# Altium project FF_FINAL_PROJECT.PrjPcb (part 2 of 3)

## Sheet ADC.SchDoc
size 420 x 297 mm; Author: Nguyễn Huy Hoàng; SheetNumber: 3; SheetTotal: 5; Instructor: Nguyễn Trung Hiếu
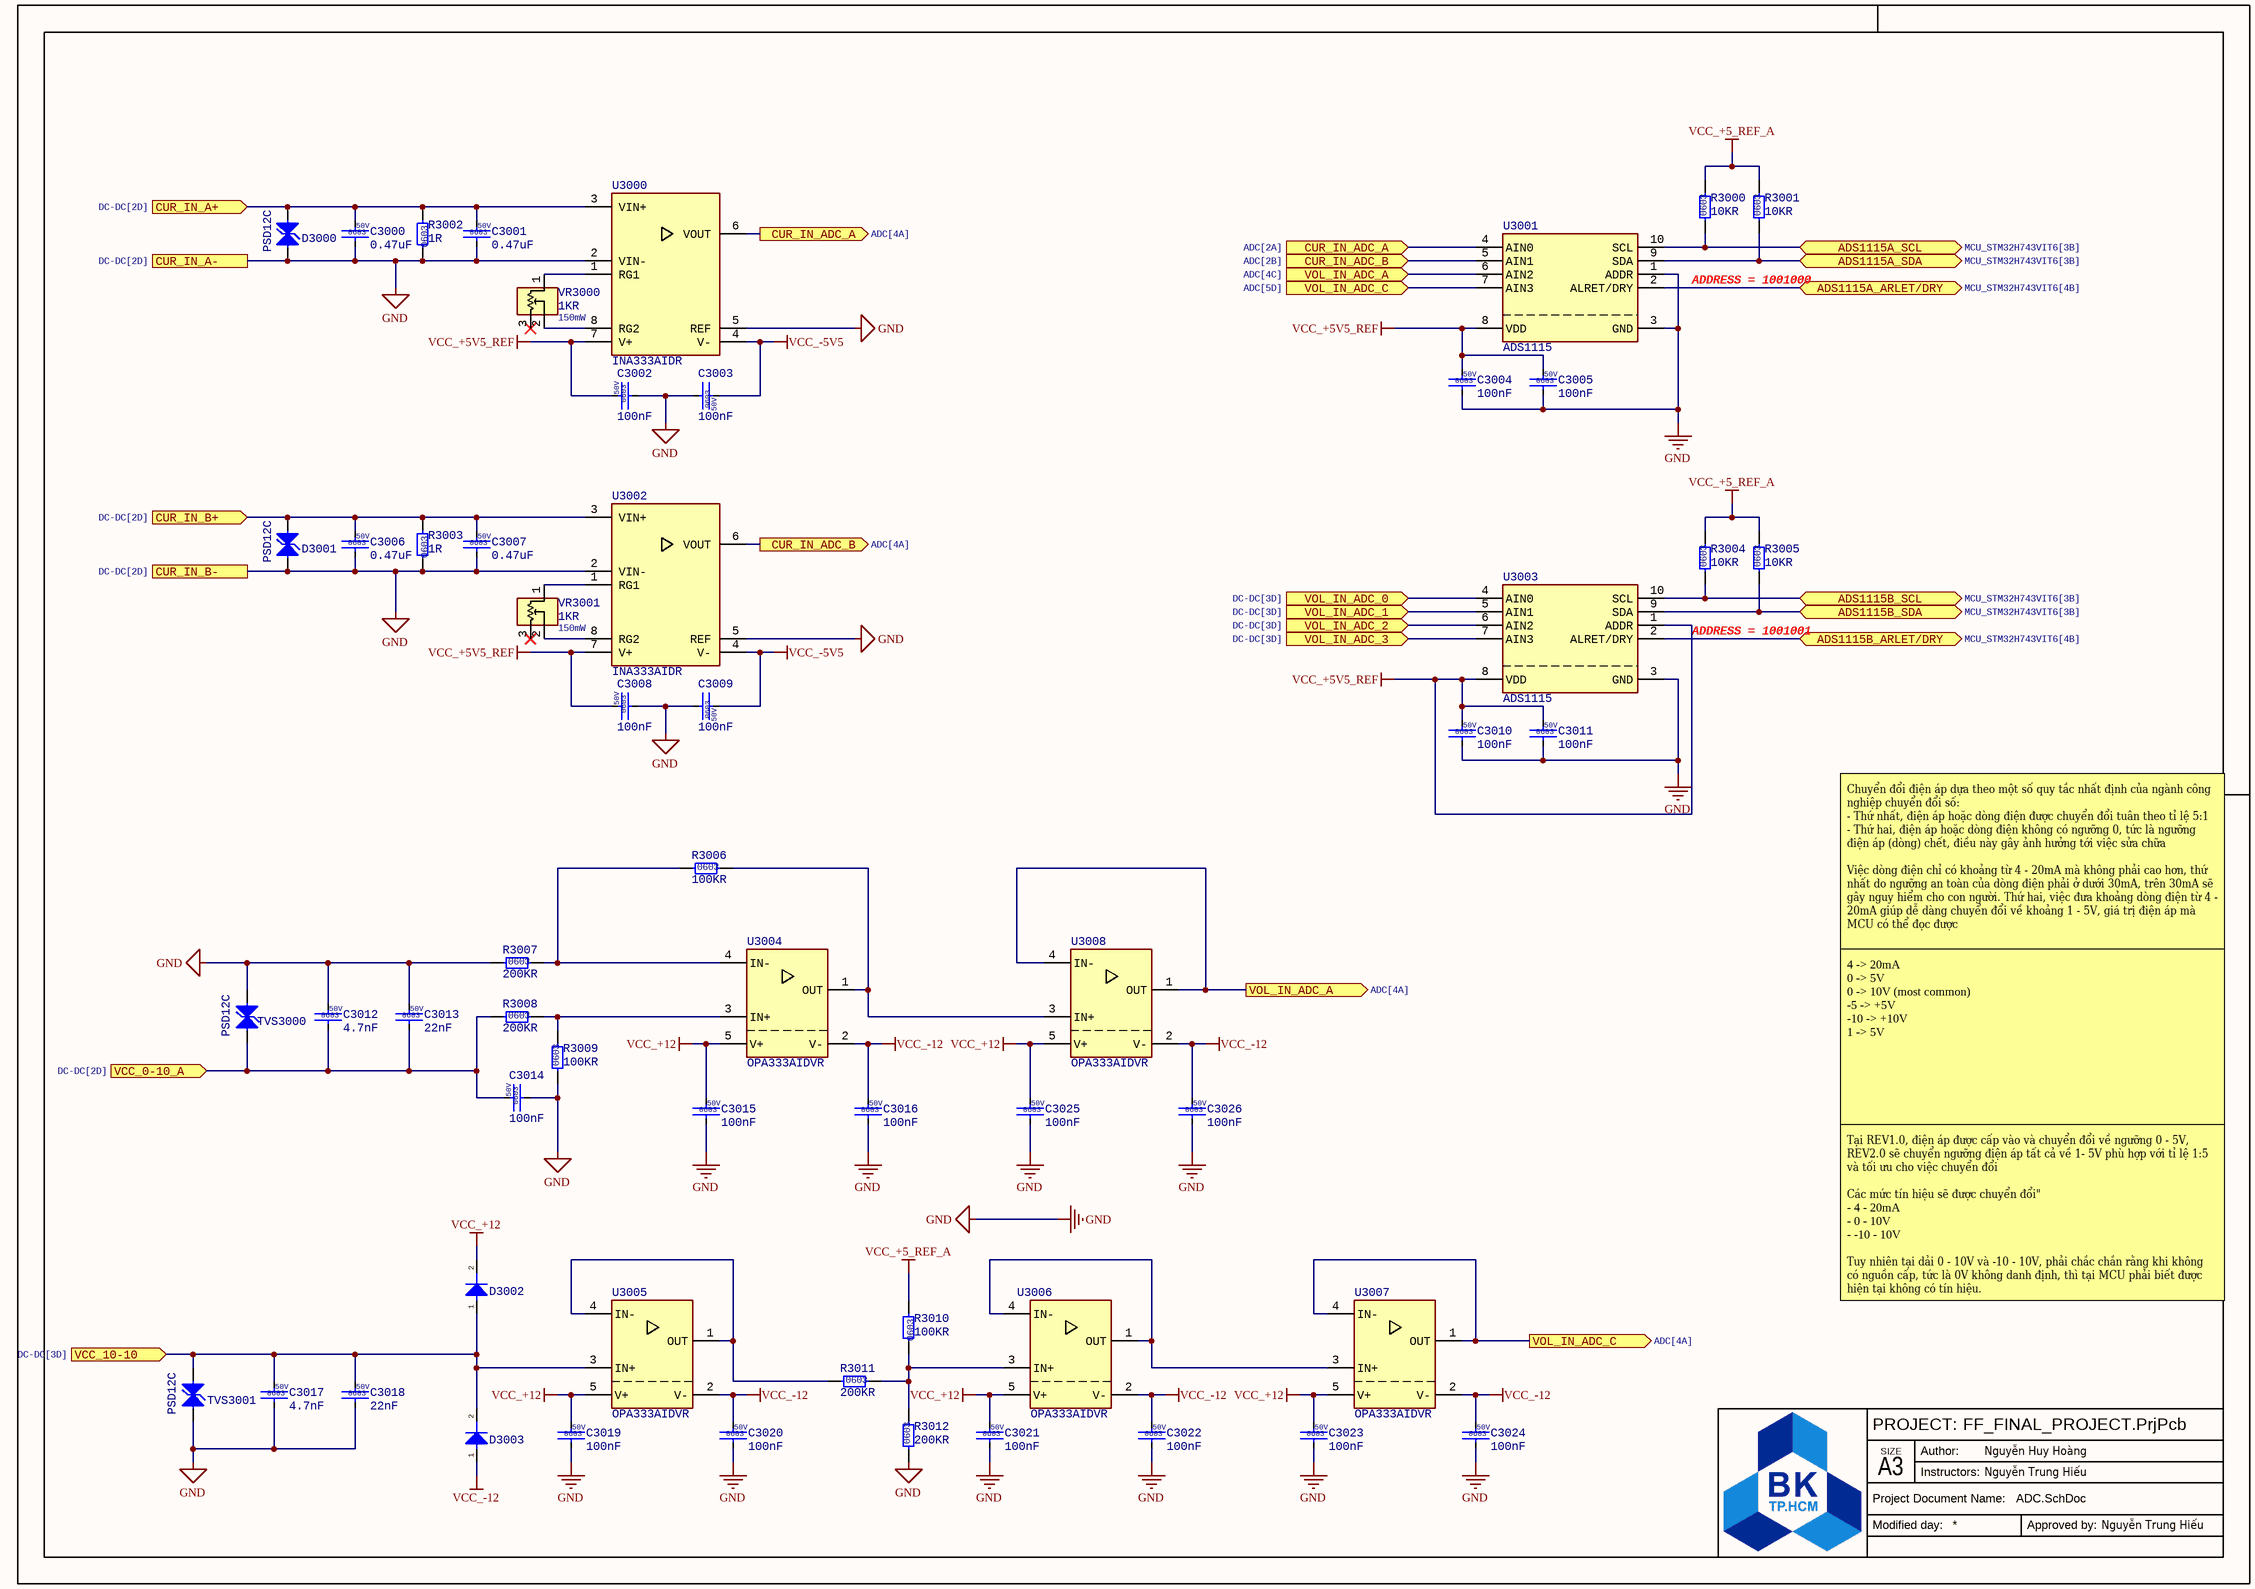
[diagram p3: ADC.SchDoc]

### Parts
C3000  0.47uF  Voltage: 50V  Size: 0603  [CAP CER 0603]
C3001  0.47uF  Voltage: 50V  Size: 0603  [CAP CER 0603]
C3002  100nF  Voltage: 50V  Size: 0603  [CAP CER 0603]
C3003  100nF  Voltage: 50V  Size: 0603  [CAP CER 0603]
C3004  100nF  Voltage: 50V  Size: 0603  [CAP CER 0603]
C3005  100nF  Voltage: 50V  Size: 0603  [CAP CER 0603]
C3006  0.47uF  Voltage: 50V  Size: 0603  [CAP CER 0603]
C3007  0.47uF  Voltage: 50V  Size: 0603  [CAP CER 0603]
C3008  100nF  Voltage: 50V  Size: 0603  [CAP CER 0603]
C3009  100nF  Voltage: 50V  Size: 0603  [CAP CER 0603]
C3010  100nF  Voltage: 50V  Size: 0603  [CAP CER 0603]
C3011  100nF  Voltage: 50V  Size: 0603  [CAP CER 0603]
C3012  4.7nF  Voltage: 50V  Size: 0603  [CAP CER 0603]
C3013  22nF  Voltage: 50V  Size: 0603  [CAP CER 0603]
C3014  100nF  Voltage: 50V  Size: 0603  [CAP CER 0603]
C3015  100nF  Voltage: 50V  Size: 0603  [CAP CER 0603]
C3016  100nF  Voltage: 50V  Size: 0603  [CAP CER 0603]
C3017  4.7nF  Voltage: 50V  Size: 0603  [CAP CER 0603]
C3018  22nF  Voltage: 50V  Size: 0603  [CAP CER 0603]
C3019  100nF  Voltage: 50V  Size: 0603  [CAP CER 0603]
C3020  100nF  Voltage: 50V  Size: 0603  [CAP CER 0603]
C3021  100nF  Voltage: 50V  Size: 0603  [CAP CER 0603]
C3022  100nF  Voltage: 50V  Size: 0603  [CAP CER 0603]
C3023  100nF  Voltage: 50V  Size: 0603  [CAP CER 0603]
C3024  100nF  Voltage: 50V  Size: 0603  [CAP CER 0603]
C3025  100nF  Voltage: 50V  Size: 0603  [CAP CER 0603]
C3026  100nF  Voltage: 50V  Size: 0603  [CAP CER 0603]
D3000  PSD12C  [SOD-323]
D3001  PSD12C  [SOD-323]
D3002  1N4148W-E3-18  [SOD-123]  (value not drawn)
D3003  1N4148W-E3-18  [SOD-123]  (value not drawn)
R3000  10KR  Size: 0603  [RESC 0603(1608) SMD]
R3001  10KR  Size: 0603  [RESC 0603(1608) SMD]
R3002  1R  Size: 0603  [RESC 0603(1608) SMD]
R3003  1R  Size: 0603  [RESC 0603(1608) SMD]
R3004  10KR  Size: 0603  [RESC 0603(1608) SMD]
R3005  10KR  Size: 0603  [RESC 0603(1608) SMD]
R3006  100KR  Size: 0603  [RESC 0603(1608) SMD]
R3007  200KR  Size: 0603  [RESC 0603(1608) SMD]
R3008  200KR  Size: 0603  [RESC 0603(1608) SMD]
R3009  100KR  Size: 0603  [RESC 0603(1608) SMD]
R3010  100KR  Size: 0603  [RESC 0603(1608) SMD]
R3011  200KR  Size: 0603  [RESC 0603(1608) SMD]
R3012  200KR  Size: 0603  [RESC 0603(1608) SMD]
TVS3000  PSD12C  [SOD-323]
TVS3001  PSD12C  [SOD-323]
U3000  INA333AIDR  [VSSOP-8]
U3001  ADS1115  [VSSOP-10]
U3002  INA333AIDR  [VSSOP-8]
U3003  ADS1115  [VSSOP-10]
U3004  OPA333AIDVR  [SOT23-5]
U3005  OPA333AIDVR  [SOT23-5]
U3006  OPA333AIDVR  [SOT23-5]
U3007  OPA333AIDVR  [SOT23-5]
U3008  OPA333AIDVR  [SOT23-5]
VR3000  1KR  Power Rate: 150mW  [VARIABLE RESISTOR]
VR3001  1KR  Power Rate: 150mW  [VARIABLE RESISTOR]

### Ports
ADS1115A_ARLET/DRY (bidir, see MCU_STM32H743VIT6[4B]), ADS1115A_SCL (bidir, see MCU_STM32H743VIT6[3B]), ADS1115A_SDA (bidir, see MCU_STM32H743VIT6[3B]), ADS1115B_ARLET/DRY (bidir, see MCU_STM32H743VIT6[4B]), ADS1115B_SCL (bidir, see MCU_STM32H743VIT6[3B]), ADS1115B_SDA (bidir, see MCU_STM32H743VIT6[3B]), CUR_IN_A+ (in, see DC-DC[2D]), CUR_IN_A- (see DC-DC[2D]), CUR_IN_ADC_A (in, see ADC[2A]), CUR_IN_ADC_A (out, see ADC[4A]), CUR_IN_ADC_B (in, see ADC[2B]), CUR_IN_ADC_B (out, see ADC[4A]), CUR_IN_B+ (in, see DC-DC[2D]), CUR_IN_B- (see DC-DC[2D]), VCC_0-10_A (in, see DC-DC[2D]), VCC_10-10 (in, see DC-DC[3D]), VOL_IN_ADC_0 (in, see DC-DC[3D]), VOL_IN_ADC_1 (in, see DC-DC[3D]), VOL_IN_ADC_2 (in, see DC-DC[3D]), VOL_IN_ADC_3 (in, see DC-DC[3D]), VOL_IN_ADC_A (in, see ADC[4C]), VOL_IN_ADC_A (out, see ADC[4A]), VOL_IN_ADC_C (in, see ADC[5D]), VOL_IN_ADC_C (out, see ADC[4A])

### Nets
GND: C3000.2 C3001.2 C3002.2 C3003.2 C3004.2 C3005.2 C3006.2 C3007.2 C3008.2 C3009.2 C3010.2 C3011.2 C3012.1 C3013.1 C3014.2 C3015.2 C3016.2 C3017.2 C3018.2 C3019.2 C3020.2 C3021.2 C3022.2 C3023.2 C3024.2 C3025.2 C3026.2 D3000.2 D3001.2 R3002.2 R3003.2 R3007.1 R3009.1 R3012.1 TVS3000.1 TVS3001.2 U3000.2(VIN-) U3000.5(REF) U3001.1(ADDR) U3001.3(GND) U3002.2(VIN-) U3002.5(REF) U3003.3(GND) ; port CUR_IN_A-, port CUR_IN_B-
VCC_+5_REF_A: R3000.2 R3001.2 R3004.2 R3005.2 R3010.1
VCC_+5V5_REF: C3002.1 C3004.1 C3005.1 C3008.1 C3010.1 C3011.1 U3000.7(V+) U3001.8(VDD) U3002.7(V+) U3003.1(ADDR) U3003.8(VDD)
VCC_+12: C3015.1 C3019.1 C3021.1 C3023.1 C3025.1 D3002.2(K) U3004.5(V+) U3005.5(V+) U3006.5(V+) U3007.5(V+) U3008.5(V+)
VCC_-5V5: C3003.1 C3009.1 U3000.4(V-) U3002.4(V-)
VCC_-12: C3016.1 C3020.1 C3022.1 C3024.1 C3026.1 D3003.1(A) U3004.2(V-) U3005.2(V-) U3006.2(V-) U3007.2(V-) U3008.2(V-)
CUR_IN_A+: C3000.1 C3001.1 D3000.1 R3002.1 U3000.3(VIN+) ; port CUR_IN_A+
CUR_IN_B+: C3006.1 C3007.1 D3001.1 R3003.1 U3002.3(VIN+) ; port CUR_IN_B+
I2C2_SCL: R3000.1 R3004.1 U3001.10(SCL) U3003.10(SCL) ; port ADS1115A_SCL, port ADS1115B_SCL
I2C2_SDA: R3001.1 R3005.1 U3001.9(SDA) U3003.9(SDA) ; port ADS1115A_SDA, port ADS1115B_SDA
MCU95: U3001.2(ALRET/DRY) ; port ADS1115A_ARLET/DRY
MCU96: U3003.2(ALRET/DRY) ; port ADS1115B_ARLET/DRY
VCC_0-10_A: C3012.2 C3013.2 C3014.1 R3008.1 TVS3000.2 ; port VCC_0-10_A
VCC_10-10: C3017.1 C3018.1 D3002.1(A) D3003.2(K) TVS3001.1 U3005.3(IN+) ; port VCC_10-10
VOL_IN_ADC_0: U3003.4(AIN0) ; port VOL_IN_ADC_0
VOL_IN_ADC_1: U3003.5(AIN1) ; port VOL_IN_ADC_1
VOL_IN_ADC_2: U3003.6(AIN2) ; port VOL_IN_ADC_2
VOL_IN_ADC_3: U3003.7(AIN3) ; port VOL_IN_ADC_3
NetR3006_1: R3006.1 R3007.2 U3004.4(IN-)
NetR3006_2: R3006.2 U3004.1(OUT) U3008.3(IN+)
NetR3008_2: R3008.2 R3009.2 U3004.3(IN+)
NetR3010_2: R3010.2 R3011.2 R3012.2 U3006.3(IN+)
NetR3011_1: R3011.1 U3005.1(OUT) U3005.4(IN-)
NetU3000_1: U3000.1(RG1) VR3000.1(a)
NetU3000_6: U3000.6(VOUT) U3001.4(AIN0) ; port CUR_IN_ADC_A
NetU3000_8: U3000.8(RG2) VR3000.2(b)
NetU3001_5: U3001.5(AIN1) U3002.6(VOUT) ; port CUR_IN_ADC_B
NetU3001_6: U3001.6(AIN2) U3008.1(OUT) U3008.4(IN-) ; port VOL_IN_ADC_A
NetU3001_7: U3001.7(AIN3) U3007.1(OUT) U3007.4(IN-) ; port VOL_IN_ADC_C
NetU3002_1: U3002.1(RG1) VR3001.1(a)
NetU3002_8: U3002.8(RG2) VR3001.2(b)
NetU3006_1: U3006.1(OUT) U3006.4(IN-) U3007.3(IN+)

Not connected (* = marked no-connect by the designer): VR3000 3(c)*; VR3001 3(c)*

### Notes on the sheet
- ADDRESS = 1001000
- ADDRESS = 1001001
- Chuyển đổi điện áp dựa theo một số quy tắc nhất định của ngành công nghiệp chuyển đổi số:
  - Thứ nhất, điện áp hoặc dòng điện được chuyển đổi tuân theo tỉ lệ 5:1
  - Thứ hai, điện áp hoặc dòng điện không có ngưỡng 0, tức là ngưỡng điện áp (dòng) chết, điều này gây ảnh hưởng tới việc sửa chữa
  Việc dòng điện chỉ có khoảng từ 4 - 20mA mà không phải cao hơn, thứ nhất do ngưỡng an toàn của dòng điện phải ở dưới 30mA, trên 30mA sẽ gây nguy hiểm cho con người. Thứ hai, việc đưa khoảng dòng điện từ 4 - 20mA giúp dễ dàng chuyển đổi về khoảng 1 - 5V, giá trị điện áp mà MCU có thể đọc được
- 4 -> 20mA
  0 -> 5V
  0 -> 10V (most common)
  -5 -> +5V
  -10 -> +10V
  1 -> 5V
- Tại REV1.0, điện áp được cấp vào và chuyển đổi về ngưỡng 0 - 5V, REV2.0 sẽ chuyển ngưỡng điện áp tất cả về 1- 5V phù hợp với tỉ lệ 1:5 và tối ưu cho việc chuyển đổi
  Các mức tín hiệu sẽ được chuyển đổi"
  - 4 - 20mA
  - 0 - 10V
  - -10 - 10V
  Tuy nhiên tại dải 0 - 10V và -10 - 10V, phải chắc chắn rằng khi không có nguồn cấp, tức là 0V không danh định, thì tại MCU phải biết được hiện tại không có tín hiệu.
- PROJECT:
- SIZE
- Author:
- Instructors:
- Project Document Name:
- Modified day:
- A3
- Approved by:

### Library data of the parts
C3000 C3001 C3006 C3007 = FF-1003: CAP CER SMD 0.47uF 10% 50V 0603; Type: CAP CER; Design Item ID: FF-1003; TH/SMD: SMD; Value: 0.47uF; Tolerance: 10%; Power Rate: N/A; Supplier: THEGIOIIC; Supplier Part Number: 10%, 0603 (1608 Metric); Supplier Link: https://www.thegioiic.com/tu-gom-0603-470nf-50v
C3002-C3005 C3008-C3011 C3014-C3016 C3019-C3026 = FF-1008: as C1018 on sheet DC-DC; Design Item ID: FF-1008; TH/SMD: SMD; Value: 100nF; Tolerance: 10%; Power Rate: N/A; Supplier: THEGIOIIC; Supplier Part Number: 10%, 0603 (1608 Metric); Supplier Link: https://www.thegioiic.com/tu-gom-0603-100nf-0-1uf-50v
C3012 C3017 = FF-1030: CAP CER SMD 4.7nF 10% 50V 0603; Type: CAP CER; Design Item ID: FF-1030; TH/SMD: SMD; Value: 4.7nF; Tolerance: 10%; Power Rate: N/A; Supplier: THEGIOIIC; Supplier Part Number: 10%, 0603 (1608 Metric); Supplier Link: https://www.thegioiic.com/tu-gom-0603-4-7nf-50v
C3013 C3018 = FF-1031: CAP CER SMD 22nF 10% 50V 0603; Type: CAP CER; Design Item ID: FF-1031; TH/SMD: SMD; Value: 22nF; Tolerance: 10%; Power Rate: N/A; Supplier: THEGIOIIC; Supplier Part Number: 10%, 0603 (1608 Metric); Supplier Link: https://www.thegioiic.com/tu-gom-0603-22nf-50v
D3000 D3001 TVS3000 TVS3001 = FF-4015: Package SOD323, Diode TVS, 50pF, 29.5V; TH/SMD: SMD; Design Item ID: FF-4015; Type: TVS DIODE; Value: 50 pF, 29.5V; Tolerance: N/A; Voltage: 29.5V; Power Rate: N/A; Size: SOD-323; Supplier: THEGIOIIC; Supplier Part Number: PSD12C; Supplier Link: https://www.thegioiic.com/psd12c
D3002 D3003 = FF-4016: Diode Standard 75V 150mA; TH/SMD: SMD; Design Item ID: FF-4016; Type: DIODE; Value: 75V 150mA; Tolerance: N/A; Voltage: 75V; Power Rate: N/A; Size: SOD-123; Supplier: THEGIOIIC; Supplier Part Number: 1N4148W-E3-18; Supplier Link: https://www.thegioiic.com/1n4148w-e3-18-diode-gen-purp-75v-150ma-sod123
R3000 R3001 R3004 R3005 = FF-0020: RESISTOR SMD 10KR OHM 1% 100mW 0603; Power Rate: 100mW; Design Item ID: FF-0020; Type: RESISTOR; TH/SMD: SMD; Value: 10KR; Tolerance: 1%; Voltage: N/A; Supplier: THEGIOIIC; Supplier Part Number: 103, 1/10W; Supplier Link: https://www.thegioiic.com/dien-tro-10-kohm-0603-1-
R3002 R3003 = FF-0011: RESISTOR SMD 1R OHM 1% 100mW 0603; Power Rate: 100mW; Design Item ID: FF-0011; Type: RESISTOR; TH/SMD: SMD; Value: 1R; Tolerance: 1%; Voltage: N/A; Supplier: THEGIOIIC; Supplier Part Number: 1R0, 1/10W; Supplier Link: https://www.thegioiic.com/dien-tro-1-ohm-0603-1-
R3006 R3009 R3010 = FF-0029: RESISTOR SMD 100KR OHM 1% 100mW 0603; Type: RESISTOR; TH/SMD: SMD; Value: 100KR; Tolerance: 1%; Voltage: N/A; Power Rate: 100mW; Supplier: THEGIOIIC; Supplier Part Number: 104, 1/10W; Supplier Link: https://www.thegioiic.com/dien-tro-100-kohm-0603-1-; Design Item ID: FF-0029
R3007 R3008 R3011 R3012 = FF-0036: RESISTOR SMD 200KR OHM 1% 100mW 0603; Type: RESISTOR; TH/SMD: SMD; Value: 200KR; Tolerance: 1%; Voltage: N/A; Power Rate: 100mW; Supplier: THEGIOIIC; Supplier Part Number: 2003, 1/10W; Supplier Link: https://www.thegioiic.com/dien-tro-200-kohm-0603-1-; Design Item ID: FF-0036
U3000 U3002 = FF-2005: INA333 Micro-Power (50μA), Zerø-Drift, Rail-to-Rail Out Instrumentation Amplifier; TH/SMD: SMD; Design Item ID: FF-2005; Type: IC; Value: INA333AIDR; Tolerance: N/A; Voltage: N/A; Power Rate: N/A; Size: VSSOP-8; Supplier: SELF
U3001 U3003 = FF-2002: ADS111x Ultra-Small, Low-Power, I2C-Compatible, 860-SPS, 16-Bit ADCs With Internal Reference, Oscillator, and Programmable Comparator; TH/SMD: SMD; Value: ADS1115; Design Item ID: FF-2002; Type: IC; Tolerance: N/A; Voltage: N/A; Power Rate: N/A; Size: VSSOP-10; Supplier: SELF
U3004-U3008 = FF-2010: OPAx333 1.8-V, microPower, CMOS Operational Amplifiers, Zero-Drift Series; TH/SMD: SMD; Design Item ID: FF-2010; Type: IC; Value: OPA333AIDVR; Tolerance: N/A; Voltage: N/A; Power Rate: N/A; Size: SOT23-5; Supplier: SELF; Supplier Link: https://shopee.vn/(10-C%C3%A1i)-Chip-100-Opa333Aidvr-OPA333-Oxq-sot23-5-M%E1%BB%9Bi-i.1003955517.21782141850?sp_atk=4701d033-6a8f-4bdf-a833-fbc55ec2f47d&xptdk=4701d033-6a8f-4bdf-a833-fbc55ec2f47d
VR3000 VR3001 = FF-0048: VARIABLE RESISTOR SMD 1KR OHM 20% 150mW N/A; Design Item ID: FF-0048; Size: N/A; Type: VARIABLE RESISTOR; TH/SMD: SMD; Value: 1KR; Tolerance: 20%; Voltage: N/A; Supplier: N/A; Supplier Part Number: 1K Ohm, 20%; Supplier Link: https://www.thegioiic.com/evm3e-102-bien-tro-1-kohm-nut-ao-smd-0-15w

## Sheet ESP32-LORA_RA_08H.SchDoc
size 420 x 297 mm; Author: Nguyễn Huy Hoàng; SheetNumber: 4; SheetTotal: 5; Instructor: Nguyễn Trung Hiếu
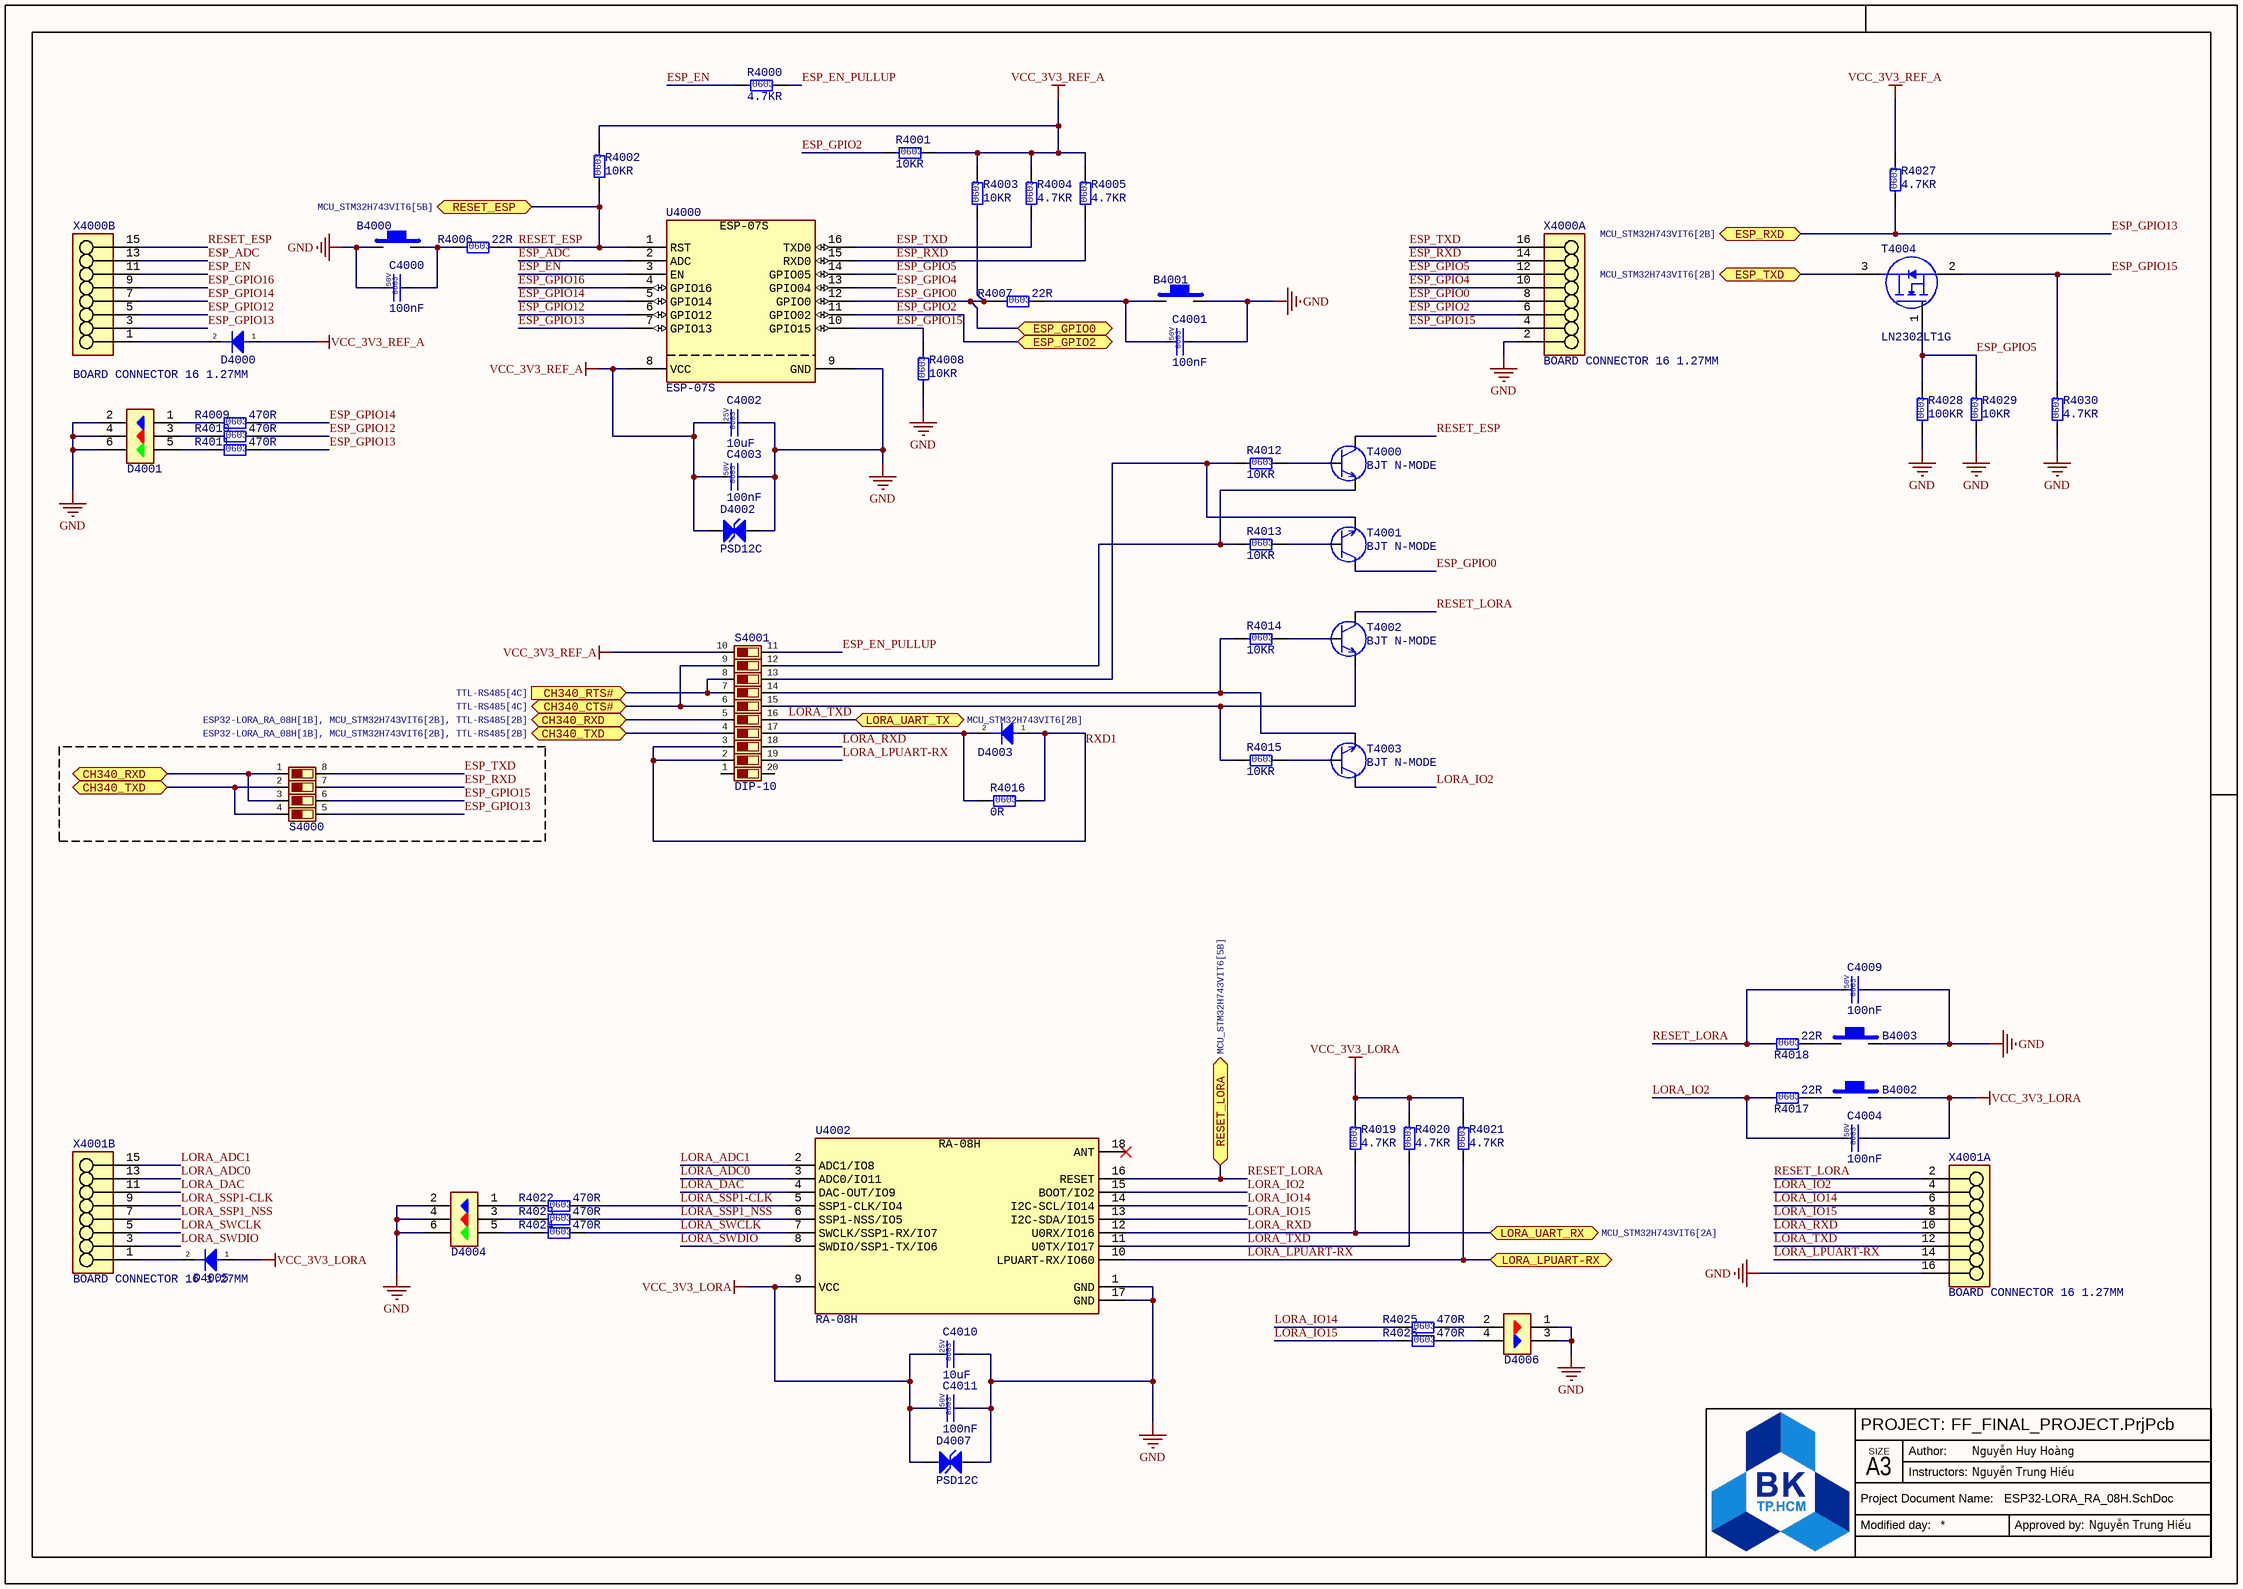
[diagram p4: ESP32-LORA_RA_08H.SchDoc]

### Parts
B4000  TACTILE 3X4MM  [TACTILE 3X4MM]  (value not drawn)
B4001  TACTILE 3X4MM  [TACTILE 3X4MM]  (value not drawn)
B4002  TACTILE 3X4MM  [TACTILE 3X4MM]  (value not drawn)
B4003  TACTILE 3X4MM  [TACTILE 3X4MM]  (value not drawn)
C4000  100nF  Voltage: 50V  Size: 0603  [CAP CER 0603]
C4001  100nF  Voltage: 50V  Size: 0603  [CAP CER 0603]
C4002  10uF  Voltage: 25V  Size: 0603  [CAP CER 0603]
C4003  100nF  Voltage: 50V  Size: 0603  [CAP CER 0603]
C4004  100nF  Voltage: 50V  Size: 0603  [CAP CER 0603]
C4009  100nF  Voltage: 50V  Size: 0603  [CAP CER 0603]
C4010  10uF  Voltage: 25V  Size: 0603  [CAP CER 0603]
C4011  100nF  Voltage: 50V  Size: 0603  [CAP CER 0603]
D4000  1N4148W-E3-18  [SOD-123]  (value not drawn)
D4001  LED RGB 5050  [LED RGB 5050]  (value not drawn)
D4002  PSD12C  [SOD-323]
D4003  1N4148W-E3-18  [SOD-123]  (value not drawn)
D4004  LED RGB 5050  [LED RGB 5050]  (value not drawn)
D4005  1N4148W-E3-18  [SOD-123]  (value not drawn)
D4006  LED R/B 0805  [LED RB 0805]  (value not drawn)
D4007  PSD12C  [SOD-323]
R4000  4.7KR  Size: 0603  [RESC 0603(1608) SMD]
R4001  10KR  Size: 0603  [RESC 0603(1608) SMD]
R4002  10KR  Size: 0603  [RESC 0603(1608) SMD]
R4003  10KR  Size: 0603  [RESC 0603(1608) SMD]
R4004  4.7KR  Size: 0603  [RESC 0603(1608) SMD]
R4005  4.7KR  Size: 0603  [RESC 0603(1608) SMD]
R4006  22R  Size: 0603  [RESC 0603(1608) SMD]
R4007  22R  Size: 0603  [RESC 0603(1608) SMD]
R4008  10KR  Size: 0603  [RESC 0603(1608) SMD]
R4009  470R  Size: 0603  [RESC 0603(1608) SMD]
R4010  470R  Size: 0603  [RESC 0603(1608) SMD]
R4011  470R  Size: 0603  [RESC 0603(1608) SMD]
R4012  10KR  Size: 0603  [RESC 0603(1608) SMD]
R4013  10KR  Size: 0603  [RESC 0603(1608) SMD]
R4014  10KR  Size: 0603  [RESC 0603(1608) SMD]
R4015  10KR  Size: 0603  [RESC 0603(1608) SMD]
R4016  0R  Size: 0603  [RESC 0603(1608) SMD]
R4017  22R  Size: 0603  [RESC 0603(1608) SMD]
R4018  22R  Size: 0603  [RESC 0603(1608) SMD]
R4019  4.7KR  Size: 0603  [RESC 0603(1608) SMD]
R4020  4.7KR  Size: 0603  [RESC 0603(1608) SMD]
R4021  4.7KR  Size: 0603  [RESC 0603(1608) SMD]
R4022  470R  Size: 0603  [RESC 0603(1608) SMD]
R4023  470R  Size: 0603  [RESC 0603(1608) SMD]
R4024  470R  Size: 0603  [RESC 0603(1608) SMD]
R4025  470R  Size: 0603  [RESC 0603(1608) SMD]
R4026  470R  Size: 0603  [RESC 0603(1608) SMD]
R4027  4.7KR  Size: 0603  [RESC 0603(1608) SMD]
R4028  100KR  Size: 0603  [RESC 0603(1608) SMD]
R4029  10KR  Size: 0603  [RESC 0603(1608) SMD]
R4030  4.7KR  Size: 0603  [RESC 0603(1608) SMD]
S4000  DIP-4  [DIP-4 SWITCH]  (value not drawn)
S4001  DIP-10  [DIP-10 SWITCH]
T4000  BJT N-MODE  [SOT23-3]
T4001  BJT N-MODE  [SOT23-3]
T4002  BJT N-MODE  [SOT23-3]
T4003  BJT N-MODE  [SOT23-3]
T4004  LN2302LT1G  [SOT23-3]
U4000  ESP-07S  [ESP-07S]
U4002  RA-08H  [RA-08H]
X4000  BOARD CONNECTOR 16 1.27MM  [BOARD CONNECTOR 16 1.27MM]  (parts A,B of 2)
X4001  BOARD CONNECTOR 16 1.27MM  [BOARD CONNECTOR 16 1.27MM]  (parts A,B of 2)

### Ports
CH340_CTS# (bidir, see TTL-RS485[4C]), CH340_RTS# (in, see TTL-RS485[4C]), CH340_RXD (bidir, see ESP32-LORA_RA_08H[1B], MCU_STM32H743VIT6[2B], TTL-RS485[2B]), CH340_RXD (bidir, see ESP32-LORA_RA_08H[2B], MCU_STM32H743VIT6[2B], TTL-RS485[2B]), CH340_TXD (bidir, see ESP32-LORA_RA_08H[1B], MCU_STM32H743VIT6[2B], TTL-RS485[2B]), CH340_TXD (bidir, see ESP32-LORA_RA_08H[2B], MCU_STM32H743VIT6[2B], TTL-RS485[2B]), ESP_GPIO0 (bidir), ESP_GPIO2 (bidir), ESP_RXD (bidir, see MCU_STM32H743VIT6[2B]), ESP_TXD (bidir, see MCU_STM32H743VIT6[2B]), LORA_LPUART-RX (bidir), LORA_UART_RX (bidir, see MCU_STM32H743VIT6[2A]), LORA_UART_TX (bidir, see MCU_STM32H743VIT6[2B]), RESET_ESP (bidir, see MCU_STM32H743VIT6[5B]), RESET_LORA (bidir, see MCU_STM32H743VIT6[5B])

### Nets
GND: B4000.1 B4001.2 B4003.2 C4000.1 C4001.2 C4002.2 C4003.2 C4009.2 C4010.2 C4011.2 D4001.2 D4001.4 D4001.6 D4002.2 D4004.2 D4004.4 D4004.6 D4006.1 D4006.3 D4007.2 R4008.1 R4028.1 R4029.1 R4030.1 U4000.9(GND) U4002.1(GND) U4002.17(GND) X4000.2 X4001.16
VCC_3V3_LORA: B4002.2 C4002.1 C4003.1 C4004.2 C4010.1 C4011.1 D4000.1(A) D4002.1 D4005.1(A) D4007.1 R4001.2 R4002.2 R4003.2 R4004.2 R4005.2 R4019.2 R4020.2 R4021.2 R4027.2 S4001.10 U4000.8(VCC) U4002.9(VCC)  [also labelled VCC_3V3_REF_A]
CH340_CTS#: S4001.6 S4001.9 ; port CH340_CTS#
CH340_RTS#: S4001.7 S4001.8 ; port CH340_RTS#
CH340_RXD: S4000.1 S4000.3 S4001.5 ; port CH340_RXD
CH340_TXD: S4000.2 S4000.4 S4001.4 ; port CH340_TXD
ESP_ADC: U4000.2(ADC) X4000.13
ESP_EN: R4000.1 U4000.3(EN) X4000.11
ESP_EN_PULLUP: R4000.2 S4001.11
ESP_GPIO0: R4003.1 R4007.1 T4001.3 U4000.12(GPIO0) X4000.8 ; port ESP_GPIO0
ESP_GPIO2: R4001.1 U4000.11(GPIO02) X4000.6 ; port ESP_GPIO2
ESP_GPIO4: U4000.13(GPIO04) X4000.10
ESP_GPIO5: R4028.2 R4029.2 T4004.1(G) U4000.14(GPIO05) X4000.12
ESP_GPIO12: R4010.2 U4000.6(GPIO12) X4000.5
ESP_GPIO13: R4011.2 R4027.1 S4000.5 U4000.7(GPIO13) X4000.3 ; port ESP_RXD
ESP_GPIO14: R4009.2 U4000.5(GPIO14) X4000.7
ESP_GPIO15: R4008.2 R4030.2 S4000.6 T4004.2(S) U4000.10(GPIO15) X4000.4
ESP_GPIO16: U4000.4(GPIO16) X4000.9
ESP_RXD: R4005.1 S4000.7 U4000.15(RXD0) X4000.14
ESP_TXD: R4004.1 S4000.8 U4000.16(TXD0) X4000.16
LORA_ADC0: U4002.3(ADC0/IO11) X4001.13
LORA_ADC1: U4002.2(ADC1/IO8) X4001.15
LORA_DAC: U4002.4(DAC-OUT/IO9) X4001.11
LORA_IO2: C4004.1 R4017.1 T4003.3 U4002.15(BOOT/IO2) X4001.4
LORA_IO14: R4025.1 U4002.14(I2C-SCL/IO14) X4001.6
LORA_IO15: R4026.1 U4002.13(I2C-SDA/IO15) X4001.8
LORA_LPUART-RX: R4021.1 S4001.19 U4002.10(LPUART-RX/IO60) X4001.14 ; port LORA_LPUART-RX
LORA_RXD: R4019.1 S4001.18 U4002.12(U0RX/IO16) X4001.10 ; port LORA_UART_RX
LORA_SSP1-CLK: R4022.2 U4002.5(SSP1-CLK/IO4) X4001.9
LORA_SSP1_NSS: R4023.2 U4002.6(SSP1-NSS/IO5) X4001.7
LORA_SWCLK: R4024.2 U4002.7(SWCLK/SSP1-RX/IO7) X4001.5
LORA_SWDIO: U4002.8(SWDIO/SSP1-TX/IO6) X4001.3
LORA_TXD: R4020.1 S4001.16 U4002.11(U0TX/IO17) X4001.12 ; port LORA_UART_TX
RESET_ESP: R4002.1 R4006.2 T4000.3 U4000.1(RST) X4000.15 ; port RESET_ESP  [project net MCU87]
RESET_LORA: C4009.1 R4018.1 T4002.3 U4002.16(RESET) X4001.2 ; port RESET_LORA  [project net MCU88]
RXD1: D4003.1(A) R4016.2 S4001.2 S4001.3
NetB4000_2: B4000.2 C4000.2 R4006.1
NetB4001_1: B4001.1 C4001.1 R4007.2
NetB4002_1: B4002.1 R4017.2
NetB4003_1: B4003.1 R4018.2
NetD4000_2: D4000.2(K) X4000.1
NetD4001_1: D4001.1 R4009.1
NetD4001_3: D4001.3 R4010.1
NetD4001_5: D4001.5 R4011.1
NetD4003_2: D4003.2(K) R4016.1 S4001.17
NetD4004_1: D4004.1 R4022.1
NetD4004_3: D4004.3 R4023.1
NetD4004_5: D4004.5 R4024.1
NetD4005_2: D4005.2(K) X4001.1
NetD4006_2: D4006.2 R4025.2
NetD4006_4: D4006.4 R4026.2
NetR4012_1: R4012.1 S4001.13 T4001.2
NetR4012_2: R4012.2 T4000.1
NetR4013_1: R4013.1 S4001.12 T4000.2
NetR4013_2: R4013.2 T4001.1
NetR4014_1: R4014.1 S4001.14 T4003.2
NetR4014_2: R4014.2 T4002.1
NetR4015_1: R4015.1 S4001.15 T4002.2
NetR4015_2: R4015.2 T4003.1
NetSB5000_1: T4004.3(D) ; port ESP_TXD

Not connected (* = marked no-connect by the designer): S4001 1 20; U4002 18(ANT)*

### Notes on the sheet
- PROJECT:
- SIZE
- Author:
- Instructors:
- Project Document Name:
- Modified day:
- A3
- Approved by:

### Library data of the parts
B4000-B4003 = FF-3007: Nút Nhấn 3x4mm Cao 2.5mm 2 Chân SMD; Design Item ID: FF-3007; Type: BUTTON; TH/SMD: SMD; Value: N/A; Tolerance: N/A; Voltage: N/A; Power Rate: N/A; Size: 3X4MM; Supplier: THEGIOIIC; Supplier Part Number: Nút Nhấn 3x4mm Cao 2.5mm 2 Chân SMD; Supplier Link: https://www.thegioiic.com/nut-nhan-3x4mm-cao-2-5mm-2-chan-smd
C4000 C4001 C4003 C4004 C4009 C4011 = FF-1008: as C1018 on sheet DC-DC; Design Item ID: FF-1008; TH/SMD: SMD; Value: 100nF; Tolerance: 10%; Power Rate: N/A; Supplier: THEGIOIIC; Supplier Part Number: 10%, 0603 (1608 Metric); Supplier Link: https://www.thegioiic.com/tu-gom-0603-100nf-0-1uf-50v
C4002 C4010 = FF-1021: CAP CER SMD 10uF 10% 25V 0603; Type: CAP CER; Design Item ID: FF-1021; TH/SMD: SMD; Value: 10uF; Tolerance: 10%; Power Rate: N/A; Supplier: THEGIOIIC; Supplier Part Number: 10%, 0603 (1608 Metric); Supplier Link: https://www.thegioiic.com/tu-gom-0603-10uf-25v
D4000 D4003 D4005 = FF-4016: Diode Standard 75V 150mA; TH/SMD: SMD; Design Item ID: FF-4016; Type: DIODE; Value: 75V 150mA; Tolerance: N/A; Voltage: 75V; Power Rate: N/A; Size: SOD-123; Supplier: THEGIOIIC; Supplier Part Number: 1N4148W-E3-18; Supplier Link: https://www.thegioiic.com/1n4148w-e3-18-diode-gen-purp-75v-150ma-sod123
D4001 D4004 = FF-4018: as D1003 on sheet DC-DC; Design Item ID: FF-4018; Type: LED RGB; TH/SMD: SMD; Tolerance: N/A; Voltage: N/A; Power Rate: N/A; Size: 5050; Supplier: THEGIOIIC; Supplier Part Number: LED RGB 5050 Dán SMD Trong Suốt; Supplier Link: https://www.thegioiic.com/led-rgb-5050-dan-smd-trong-suot
D4002 D4007 = FF-4015: as D3000 on sheet ADC; Design Item ID: FF-4015; Type: TVS DIODE; Value: 50 pF, 29.5V; Tolerance: N/A; Voltage: 29.5V; Power Rate: N/A; Size: SOD-323; Supplier: THEGIOIIC; Supplier Part Number: PSD12C; Supplier Link: https://www.thegioiic.com/psd12c
D4006 = FF-4019: LED 2 Màu Đỏ, Xanh Dương 0805 Dán SMD Trong Suốt; Type: LED R/B; Value: 0805; Design Item ID: FF-4019; TH/SMD: SMD; Tolerance: N/A; Voltage: N/A; Power Rate: N/A; Size: 0805; Supplier: THEGIOIIC; Supplier Part Number: LED 2 Màu Đỏ, Xanh Dương 0805 Dán SMD Trong Suốt; Supplier Link: https://www.thegioiic.com/led-2-mau-do-xanh-duong-0805-dan-smd-trong-suot
R4000 R4004 R4005 R4019-R4021 R4027 R4030 = FF-0016: RESISTOR SMD 4.7KR OHM 1% 100mW 0603; Power Rate: 100mW; Design Item ID: FF-0016; Type: RESISTOR; TH/SMD: SMD; Value: 4.7KR; Tolerance: 1%; Voltage: N/A; Supplier: THEGIOIIC; Supplier Part Number: 472, 1/10W; Supplier Link: https://www.thegioiic.com/dien-tro-4-7-kohm-0603-1-
R4001-R4003 R4008 R4012-R4015 R4029 = FF-0020: RESISTOR SMD 10KR OHM 1% 100mW 0603; Power Rate: 100mW; Design Item ID: FF-0020; Type: RESISTOR; TH/SMD: SMD; Value: 10KR; Tolerance: 1%; Voltage: N/A; Supplier: THEGIOIIC; Supplier Part Number: 103, 1/10W; Supplier Link: https://www.thegioiic.com/dien-tro-10-kohm-0603-1-
R4006 R4007 R4017 R4018 = FF-0049: RESISTOR SMD 22R OHM 1% 100mW 0603; Power Rate: 100mW; Design Item ID: FF-0049; Type: RESISTOR; TH/SMD: SMD; Value: 22R; Tolerance: 1%; Voltage: N/A; Supplier: THEGIOIIC; Supplier Part Number: 22R (Code 220), 1/10W; Supplier Link: https://www.thegioiic.com/dien-tro-22-ohm-0603-1-
R4009-R4011 R4022-R4026 = FF-0050: RESISTOR SMD 470R OHM 1% 100mW 0603; Power Rate: 100mW; Design Item ID: FF-0050; Type: RESISTOR; TH/SMD: SMD; Value: 470R; Tolerance: 1%; Voltage: N/A; Supplier: THEGIOIIC; Supplier Part Number: Code 471, 1/10W; Supplier Link: https://www.thegioiic.com/dien-tro-470-ohm-0603-1-
R4016 = FF-0003: RESISTOR SMD 0R OHM 1% 100mW 0603; Power Rate: 100mW; Design Item ID: FF-0003; Type: RESISTOR; TH/SMD: SMD; Value: 0R; Tolerance: 1%; Voltage: N/A; Supplier: THEGIOIIC; Supplier Part Number: 0R0, 1/10W; Supplier Link: https://www.thegioiic.com/dien-tro-0-ohm-0603-1-
R4028 = FF-0029: RESISTOR SMD 100KR OHM 1% 100mW 0603; Power Rate: 100mW; Design Item ID: FF-0029; Type: RESISTOR; TH/SMD: SMD; Value: 100KR; Tolerance: 1%; Voltage: N/A; Supplier: THEGIOIIC; Supplier Part Number: 104, 1/10W; Supplier Link: https://www.thegioiic.com/dien-tro-100-kohm-0603-1-
S4000 = FF-3011: DIP SWITCH 1.27mm 4PIN; TH/SMD: SMD; Design Item ID: FF-3011; Type: SWITCH; Value: N/A; Tolerance: N/A; Voltage: N/A; Power Rate: N/A; Size: 4 X 1.27mm; Supplier: THEGIOIIC; Supplier Part Number: Công Tắc DIP Switch Dán SMD 1 Bit 1.27mm; Supplier Link: https://www.thegioiic.com/cong-tac-dip-switch-dan-smd-4-bit-1-27mm
S4001 = FF-3013: DIP SWITCH 1.27mm 10PIN; TH/SMD: SMD; Design Item ID: FF-3013; Type: SWITCH; Value: N/A; Tolerance: N/A; Voltage: N/A; Power Rate: N/A; Size: 10 X 1.27mm; Supplier: THEGIOIIC; Supplier Part Number: Công Tắc DIP Switch Dán SMD 10 Bit 1.27mm; Supplier Link: https://www.thegioiic.com/cong-tac-dip-switch-dan-smd-10-bit-1-27mm
T4000-T4003 = FF-4024: 2SC1815-HF Transistor NPN 50V 0.15A; TH/SMD: SMD; Design Item ID: FF-4024; Type: Transistor; Value: N/A; Tolerance: N/A; Voltage: 50V; Power Rate: 0.15A; Size: SOT23-3; Supplier: THEGIOIIC; Supplier Part Number: 2SC1815-HF Transistor NPN 50V 0.15A 3 Chân SOT-23; Supplier Link: https://www.thegioiic.com/2sc1815-hf-transistor-npn-50v-0-15a-3-chan-sot-23
T4004 = FF-4001: 20V N-Channel Enhancement-Mode MOSFET; Type: TRANSISTOR; TH/SMD: SMD; Value: 20V-2.8A-N; Design Item ID: FF-4001; Tolerance: N/A; Voltage: 20V; Power Rate: N/A; Size: SOT23-3; Supplier: THEGIOIIC; Supplier Part Number: LN2302LT1G; Supplier Link: https://www.thegioiic.com/ln2302lt1g-mosfet-kenh-n
U4000 = FF-2018: ESP-07S WiFi module; TH/SMD: SMD; Design Item ID: FF-2018; Type: MODULE; Value: ESP-07S; Tolerance: N/A; Voltage: N/A; Power Rate: N/A; Size: ESP-07S; Supplier: THEGIOIIC; Supplier Part Number: ESP-07S AI-Thinker ESP8266 Mạch Thu Phát WiFi; Supplier Link: https://www.thegioiic.com/esp-07s-ai-thinker-esp8266-mach-thu-phat-wifi
U4002 = FF-2019: 803 - 930MHz LORAWAN MODULE; TH/SMD: SMD; Design Item ID: FF-2019; Type: MODULE; Value: RA-08H; Tolerance: N/A; Voltage: N/A; Power Rate: N/A; Size: RA-08H; Supplier: N/A; Supplier Part Number: N/A; Supplier Link: N/A
X4000 X4001 = FF-3008: Hàng Rào Đực Đôi 1.27mm 60 Chân 2 hàng SMD; Design Item ID: FF-3008; Type: CONNECTOR; TH/SMD: SMD; Value: N/A; Tolerance: N/A; Voltage: N/A; Power Rate: N/A; Size: 2 X 1.27mm; Supplier: THEGIOIIC; Supplier Part Number: Hàng Rào Đực Đôi 1.27mm 60 Chân 2 hàng SMD; Supplier Link: https://www.thegioiic.com/hang-rao-duc-doi-1-27mm-60-chan-2-hang-smd

## Sheet MCU_STM32H743VIT6.SchDoc
size A2; Author: Nguyễn Huy Hoàng; SheetNumber: 5; SheetTotal: 5; Instructor: Nguyễn Trung Hiếu
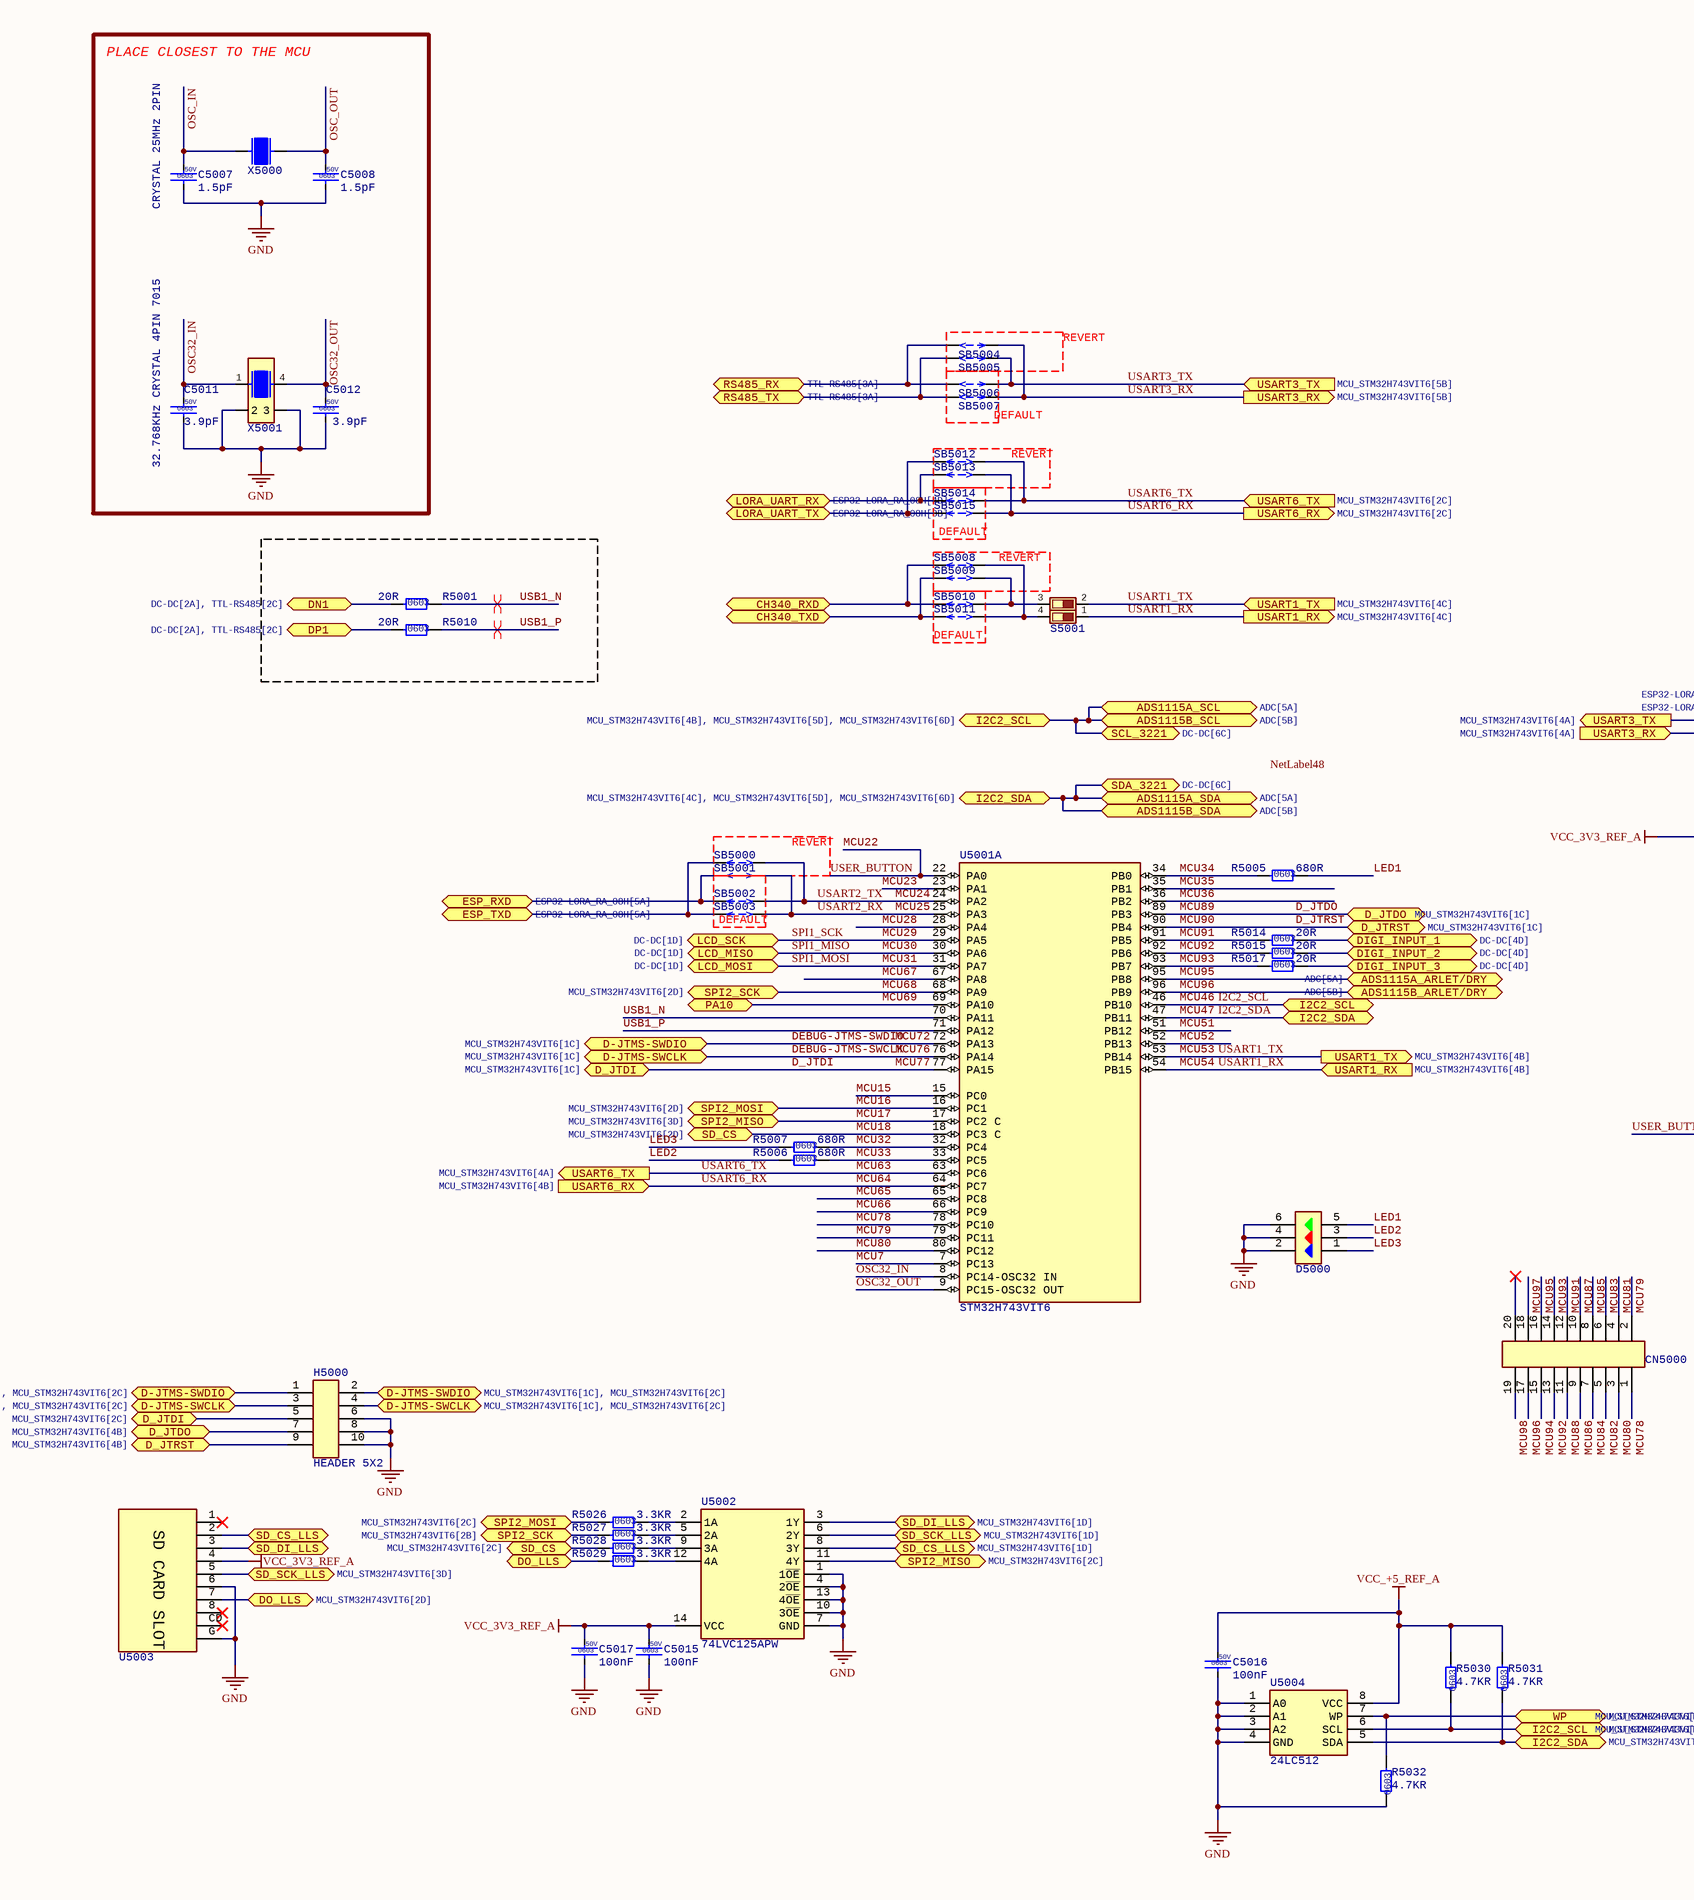
[diagram p5: MCU_STM32H743VIT6.SchDoc, left]
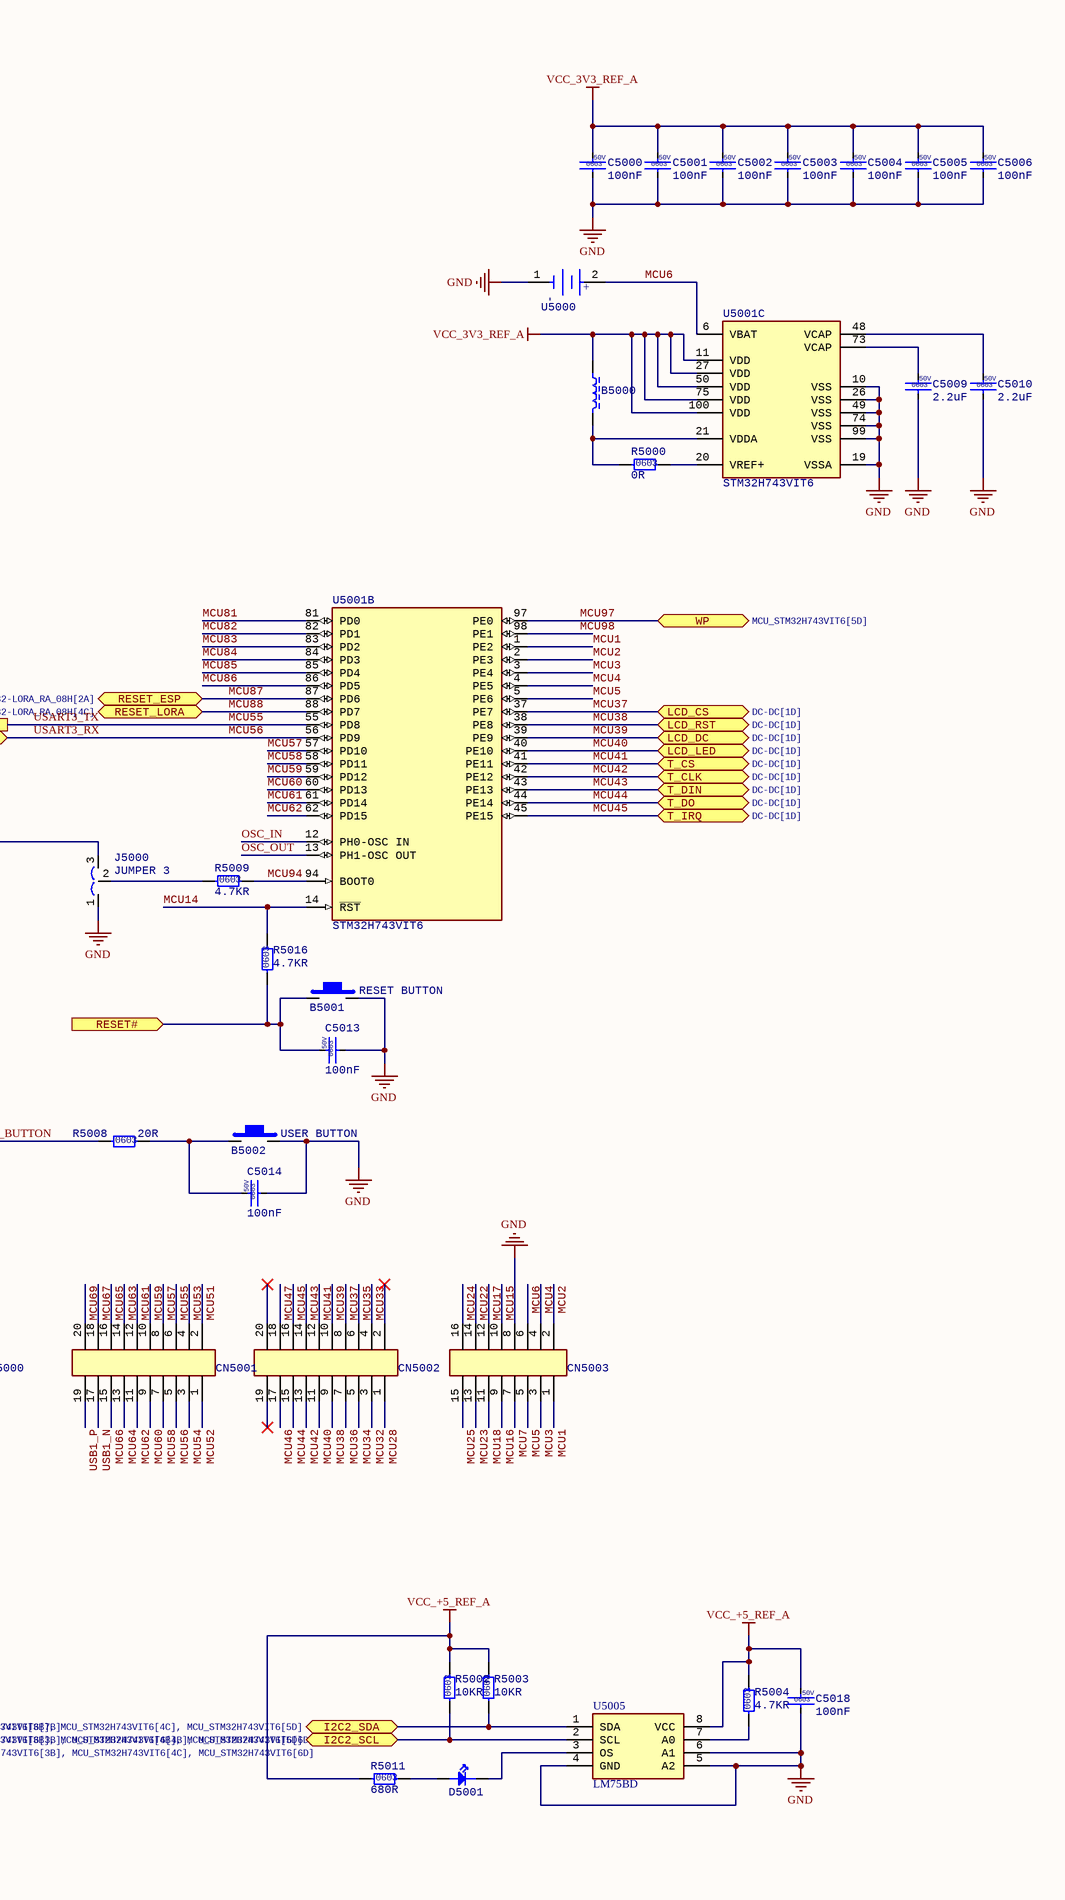
[diagram p6: MCU_STM32H743VIT6.SchDoc, right]

### Parts
B5000  FERRITE BEAD 600 OHM  [FERRITE BEAD 0603]  (value not drawn)
B5001  RESET BUTTON  [TACTILE 3X4MM]
B5002  USER BUTTON  [TACTILE 3X4MM]
C5000  100nF  Voltage: 50V  Size: 0603  [CAP CER 0603]
C5001  100nF  Voltage: 50V  Size: 0603  [CAP CER 0603]
C5002  100nF  Voltage: 50V  Size: 0603  [CAP CER 0603]
C5003  100nF  Voltage: 50V  Size: 0603  [CAP CER 0603]
C5004  100nF  Voltage: 50V  Size: 0603  [CAP CER 0603]
C5005  100nF  Voltage: 50V  Size: 0603  [CAP CER 0603]
C5006  100nF  Voltage: 50V  Size: 0603  [CAP CER 0603]
C5007  1.5pF  Voltage: 50V  Size: 0603  [CAP CER 0603]
C5008  1.5pF  Voltage: 50V  Size: 0603  [CAP CER 0603]
C5009  2.2uF  Voltage: 50V  Size: 0603  [CAP CER 0603]
C5010  2.2uF  Voltage: 50V  Size: 0603  [CAP CER 0603]
C5011  3.9pF  Voltage: 50V  Size: 0603  [CAP CER 0603]
C5012  3.9pF  Voltage: 50V  Size: 0603  [CAP CER 0603]
C5013  100nF  Voltage: 50V  Size: 0603  [CAP CER 0603]
C5014  100nF  Voltage: 50V  Size: 0603  [CAP CER 0603]
C5015  100nF  Voltage: 50V  Size: 0603  [CAP CER 0603]
C5016  100nF  Voltage: 50V  Size: 0603  [CAP CER 0603]
C5017  100nF  Voltage: 50V  Size: 0603  [CAP CER 0603]
C5018  100nF  Voltage: 50V  Size: 0603  [CAP CER 0603]
CN5000  SMD HEADER 10X2X2.54MM  [SMD HEADER 10X2X2.54MM]  (value not drawn)
CN5001  SMD HEADER 10X2X2.54MM  [SMD HEADER 10X2X2.54MM]  (value not drawn)
CN5002  SMD HEADER 10X2X2.54MM  [SMD HEADER 10X2X2.54MM]  (value not drawn)
CN5003  SMD HEADER 8X2X2.54MM  [SMD HEADER 8X2X2.54MM]  (value not drawn)
D5000  LED RGB 5050  [LED RGB 5050]  (value not drawn)
D5001  LED RED  [LED RED 0603]  (value not drawn)
H5000  HEADER 5X2  [HEADER 5X2]
J5000  JUMPER 3  [JUMPER 3]
R5000  0R  Size: 0603  [RESC 0603(1608) SMD]
R5001  20R  Size: 0603  [RESC 0603(1608) SMD]
R5002  10KR  Size: 0603  [RESC 0603(1608) SMD]
R5003  10KR  Size: 0603  [RESC 0603(1608) SMD]
R5004  4.7KR  Size: 0603  [RESC 0603(1608) SMD]
R5005  680R  Size: 0603  [RESC 0603(1608) SMD]
R5006  680R  Size: 0603  [RESC 0603(1608) SMD]
R5007  680R  Size: 0603  [RESC 0603(1608) SMD]
R5008  20R  Size: 0603  [RESC 0603(1608) SMD]
R5009  4.7KR  Size: 0603  [RESC 0603(1608) SMD]
R5010  20R  Size: 0603  [RESC 0603(1608) SMD]
R5011  680R  Size: 0603  [RESC 0603(1608) SMD]
R5014  20R  Size: 0603  [RESC 0603(1608) SMD]
R5015  20R  Size: 0603  [RESC 0603(1608) SMD]
R5016  4.7KR  Size: 0603  [RESC 0603(1608) SMD]
R5017  20R  Size: 0603  [RESC 0603(1608) SMD]
R5026  3.3KR  Size: 0603  [RESC 0603(1608) SMD]
R5027  3.3KR  Size: 0603  [RESC 0603(1608) SMD]
R5028  3.3KR  Size: 0603  [RESC 0603(1608) SMD]
R5029  3.3KR  Size: 0603  [RESC 0603(1608) SMD]
R5030  4.7KR  Size: 0603  [RESC 0603(1608) SMD]
R5031  4.7KR  Size: 0603  [RESC 0603(1608) SMD]
R5032  4.7KR  Size: 0603  [RESC 0603(1608) SMD]
S5001  DIP-2  [DIP-2 SWITCH]  (value not drawn)
SB5000  SB  [SB]  (value not drawn)
SB5001  SB  [SB]  (value not drawn)
SB5002  SB  [SB]  (value not drawn)
SB5003  SB  [SB]  (value not drawn)
SB5004  SB  [SB]  (value not drawn)
SB5005  SB  [SB]  (value not drawn)
SB5006  SB  [SB]  (value not drawn)
SB5007  SB  [SB]  (value not drawn)
SB5008  SB  [SB]  (value not drawn)
SB5009  SB  [SB]  (value not drawn)
SB5010  SB  [SB]  (value not drawn)
SB5011  SB  [SB]  (value not drawn)
SB5012  SB  [SB]  (value not drawn)
SB5013  SB  [SB]  (value not drawn)
SB5014  SB  [SB]  (value not drawn)
SB5015  SB  [SB]  (value not drawn)
U5000  BS-6  [BS-6]  (value not drawn)
U5001  STM32H743VIT6  [LQFP-100-A]  (parts A,B,C of 3)
U5002  74LVC125APW  [TSSOP-14]
U5003  MiSD-PP-9P-V2  [MiSD-PP-9P-V2]  (value not drawn)
U5004  24LC512  [SOIC-8]
U5005  LM75BD  [SOP-8]
X5000  CRYSTAL 25MHz 2PIN  [CRYSTAL 5032 2PIN]
X5001  32.768KHz CRYSTAL 4PIN 7015  [CRYSTAL 32.768KHz 7015]

### Blocks framed on the sheet
PLACE CLOSEST TO THE MCU: C5007 C5008 C5011 C5012 X5000 X5001
DEFAULT: SB5006 SB5007
DEFAULT: SB5014 SB5015
REVERT: SB5012 SB5013
DEFAULT: SB5010 SB5011
REVERT: SB5008 SB5009
REVERT: SB5000 SB5001
DEFAULT: SB5002 SB5003

### Ports
ADS1115A_ARLET/DRY (bidir, see ADC[5A]), ADS1115A_SCL (bidir, see ADC[5A]), ADS1115A_SDA (bidir, see ADC[5A]), ADS1115B_ARLET/DRY (bidir, see ADC[5B]), ADS1115B_SCL (bidir, see ADC[5B]), ADS1115B_SDA (bidir, see ADC[5B]), CH340_RXD (bidir, see ESP32-LORA_RA_08H[1B], ESP32-LORA_RA_08H[2B], TTL-RS485[2B]), CH340_TXD (bidir, see ESP32-LORA_RA_08H[1B], ESP32-LORA_RA_08H[2B], TTL-RS485[2B]), D-JTMS-SWCLK (bidir, see MCU_STM32H743VIT6[1C]), D-JTMS-SWCLK (bidir, see MCU_STM32H743VIT6[1C], MCU_STM32H743VIT6[2C]), D-JTMS-SWDIO (bidir, see MCU_STM32H743VIT6[1C]), D-JTMS-SWDIO (bidir, see MCU_STM32H743VIT6[1C], MCU_STM32H743VIT6[2C]), D_JTDI (bidir, see MCU_STM32H743VIT6[1C]), D_JTDI (bidir, see MCU_STM32H743VIT6[2C]), D_JTDO (bidir, see MCU_STM32H743VIT6[1C]), D_JTDO (bidir, see MCU_STM32H743VIT6[4B]), D_JTRST (bidir, see MCU_STM32H743VIT6[1C]), D_JTRST (bidir, see MCU_STM32H743VIT6[4B]), DIGI_INPUT_1 (bidir, see DC-DC[4D]), DIGI_INPUT_2 (bidir, see DC-DC[4D]), DIGI_INPUT_3 (bidir, see DC-DC[4D]), DN1 (bidir, see DC-DC[2A], TTL-RS485[2C]), DO_LLS (bidir, see MCU_STM32H743VIT6[1D]), DO_LLS (bidir, see MCU_STM32H743VIT6[2D]), DP1 (bidir, see DC-DC[2A], TTL-RS485[2C]), ESP_RXD (bidir, see ESP32-LORA_RA_08H[5A]), ESP_TXD (bidir, see ESP32-LORA_RA_08H[5A]), I2C2_SCL (bidir, see MCU_STM32H743VIT6[3B], MCU_STM32H743VIT6[4B], MCU_STM32H743VIT6[5D]), I2C2_SCL (bidir, see MCU_STM32H743VIT6[3B], MCU_STM32H743VIT6[4B], MCU_STM32H743VIT6[6D]), I2C2_SCL (bidir, see MCU_STM32H743VIT6[3B], MCU_STM32H743VIT6[5D], MCU_STM32H743VIT6[6D]), I2C2_SCL (bidir, see MCU_STM32H743VIT6[4B], MCU_STM32H743VIT6[5D], MCU_STM32H743VIT6[6D]), I2C2_SDA (bidir, see MCU_STM32H743VIT6[3B], MCU_STM32H743VIT6[4C], MCU_STM32H743VIT6[5D]), I2C2_SDA (bidir, see MCU_STM32H743VIT6[3B], MCU_STM32H743VIT6[4C], MCU_STM32H743VIT6[6D]), I2C2_SDA (bidir, see MCU_STM32H743VIT6[3B], MCU_STM32H743VIT6[5D], MCU_STM32H743VIT6[6D]), I2C2_SDA (bidir, see MCU_STM32H743VIT6[4C], MCU_STM32H743VIT6[5D], MCU_STM32H743VIT6[6D]), LCD_CS (bidir, see DC-DC[1D]), LCD_DC (bidir, see DC-DC[1D]), LCD_LED (bidir, see DC-DC[1D]), LCD_MISO (bidir, see DC-DC[1D]), LCD_MOSI (bidir, see DC-DC[1D]), LCD_RST (bidir, see DC-DC[1D]), LCD_SCK (bidir, see DC-DC[1D]), LORA_UART_RX (bidir, see ESP32-LORA_RA_08H[4D]), LORA_UART_TX (bidir, see ESP32-LORA_RA_08H[3B]), PA10 (bidir), RESET# (in), RESET_ESP (bidir, see ESP32-LORA_RA_08H[2A]), RESET_LORA (bidir, see ESP32-LORA_RA_08H[4C]), RS485_RX (bidir, see TTL-RS485[3A]), RS485_TX (bidir, see TTL-RS485[3A]), SCL_3221 (bidir, see DC-DC[6C]), SD_CS (bidir, see MCU_STM32H743VIT6[2C]), SD_CS (bidir, see MCU_STM32H743VIT6[2D]), SD_CS_LLS (bidir, see MCU_STM32H743VIT6[1D]), SD_CS_LLS (bidir, see MCU_STM32H743VIT6[3D]), SD_DI_LLS (bidir, see MCU_STM32H743VIT6[1D]), SD_DI_LLS (bidir, see MCU_STM32H743VIT6[3D]), SD_SCK_LLS (bidir, see MCU_STM32H743VIT6[1D]), SD_SCK_LLS (bidir, see MCU_STM32H743VIT6[3D]), SDA_3221 (bidir, see DC-DC[6C]), SPI2_MISO (bidir, see MCU_STM32H743VIT6[2C]), SPI2_MISO (bidir, see MCU_STM32H743VIT6[3D]), SPI2_MOSI (bidir, see MCU_STM32H743VIT6[2C]), SPI2_MOSI (bidir, see MCU_STM32H743VIT6[2D]), SPI2_SCK (bidir, see MCU_STM32H743VIT6[2B]), SPI2_SCK (bidir, see MCU_STM32H743VIT6[2D]), T_CLK (bidir, see DC-DC[1D]), T_CS (bidir, see DC-DC[1D]), T_DIN (bidir, see DC-DC[1D]), T_DO (bidir, see DC-DC[1D]), T_IRQ (bidir, see DC-DC[1D]), USART1_RX (in, see MCU_STM32H743VIT6[4B]), USART1_RX (out, see MCU_STM32H743VIT6[4C]), USART1_TX (in, see MCU_STM32H743VIT6[4C]), USART1_TX (out, see MCU_STM32H743VIT6[4B]), USART3_RX (in, see MCU_STM32H743VIT6[4A]), USART3_RX (out, see MCU_STM32H743VIT6[5B]), USART3_TX (in, see MCU_STM32H743VIT6[5B]), USART3_TX (out, see MCU_STM32H743VIT6[4A]), USART6_RX (in, see MCU_STM32H743VIT6[4B]), USART6_RX (out, see MCU_STM32H743VIT6[2C]), USART6_TX (in, see MCU_STM32H743VIT6[2C]), USART6_TX (out, see MCU_STM32H743VIT6[4A]), WP (bidir, see MCU_STM32H743VIT6[5D]), WP (bidir, see MCU_STM32H743VIT6[7B])

### Nets
GND: B5001.2 B5002.2 C5000.2 C5001.2 C5002.2 C5003.2 C5004.2 C5005.2 C5006.2 C5007.2 C5008.2 C5009.2 C5010.2 C5011.2 C5012.2 C5013.2 C5014.2 C5015.2 C5016.2 C5017.2 C5018.2 CN5003.8 D5000.2 D5000.4 D5000.6 H5000.6 H5000.8 H5000.10 J5000.1 R5032.2 U5000.1(C) U5001.10(VSS) U5001.19(VSSA) U5001.26(VSS) U5001.49(VSS) U5001.74(VSS) U5001.99(VSS) U5002.1(1~{OE}) U5002.4(2~{OE}) U5002.7(GND) U5002.10(3~{OE}) U5002.13(4~{OE}) U5003.6 U5003.G U5004.1(A0) U5004.2(A1) U5004.3(A2) U5004.4(GND) U5005.4(GND) U5005.5(A2) U5005.6(A1) X5001.2 X5001.3
VCC_3V3_REF_A: B5000.1 C5000.1 C5001.1 C5002.1 C5003.1 C5004.1 C5005.1 C5006.1 C5015.1 C5017.1 J5000.3 U5001.11(VDD) U5001.27(VDD) U5001.50(VDD) U5001.75(VDD) U5001.100(VDD) U5002.14(VCC) U5003.4  [project net VCC_3V3_LORA]
VCC_+5_REF_A: C5016.1 C5018.1 R5002.2 R5003.2 R5004.2 R5011.1 R5030.1 R5031.1 U5004.8(VCC) U5005.8(VCC)
CH340_RXD: SB5008.1 SB5010.1 ; port CH340_RXD
CH340_TXD: SB5009.1 SB5011.1 ; port CH340_TXD
D1_N: R5001.1 ; port DN1
D1_P: R5010.1 ; port DP1
D_JTDI: H5000.5 U5001.77(PA15) ; port D_JTDI  [also labelled MCU77]
D_JTDO: H5000.7 U5001.89(PB3) ; port D_JTDO  [also labelled MCU89]
D_JTRST: H5000.9 U5001.90(PB4) ; port D_JTRST  [also labelled MCU90]
DEBUG-JTMS-SWCLK: H5000.3 H5000.4 U5001.76(PA14) ; port D-JTMS-SWCLK  [also labelled MCU76]
DEBUG-JTMS-SWDIO: H5000.1 H5000.2 U5001.72(PA13) ; port D-JTMS-SWDIO  [also labelled MCU72]
DIGI_INPUT_1: R5014.2 ; port DIGI_INPUT_1
DIGI_INPUT_2: R5015.2 ; port DIGI_INPUT_2
DIGI_INPUT_3: R5017.2 ; port DIGI_INPUT_3
ESP_GPIO13: SB5001.1 SB5002.1 ; port ESP_RXD
I2C2_SCL: CN5002.17 R5002.1 R5030.2 U5001.46(PB10) U5004.6(SCL) U5005.2(SCL) ; port ADS1115A_SCL, port ADS1115B_SCL, port SCL_3221, port I2C2_SCL  [also labelled MCU46]
I2C2_SDA: CN5002.18 R5003.1 R5031.2 U5001.47(PB11) U5004.5(SDA) U5005.1(SDA) ; port ADS1115A_SDA, port ADS1115B_SDA, port SDA_3221, port I2C2_SDA  [also labelled MCU47]
LED1: D5000.5 R5005.2
LED2: D5000.3 R5006.1
LED3: D5000.1 R5007.1
LORA_RXD: SB5013.1 SB5014.1 ; port LORA_UART_RX
LORA_TXD: SB5012.1 SB5015.1 ; port LORA_UART_TX
MCU1: CN5003.1 U5001.1(PE2)
MCU2: CN5003.2 U5001.2(PE3)
MCU3: CN5003.3 U5001.3(PE4)
MCU4: CN5003.4 U5001.4(PE5)
MCU5: CN5003.5 U5001.5(PE6)
MCU6: CN5003.6 U5000.2(A) U5001.6(VBAT)
MCU7: CN5003.7 U5001.7(PC13)
MCU14: R5016.2 U5001.14(~{RST})
MCU15: CN5003.10 U5001.15(PC0)
MCU16: CN5003.9 R5026.1 U5001.16(PC1) ; port SPI2_MOSI
MCU17: CN5003.12 U5001.17(PC2_C) U5002.11(4Y) ; port SPI2_MISO
MCU18: CN5003.11 R5028.1 U5001.18(PC3_C) ; port SD_CS
MCU22: CN5003.14 R5008.1 U5001.22(PA0)  [also labelled USER_BUTTON]
MCU23: CN5003.13 U5001.23(PA1)
MCU24: CN5003.16 SB5000.2 SB5002.2 U5001.24(PA2)  [also labelled USART2_TX]
MCU25: CN5003.15 SB5001.2 SB5003.2 U5001.25(PA3)  [also labelled USART2_RX]
MCU28: CN5002.1 U5001.28(PA4)
MCU29: U5001.29(PA5) ; port LCD_SCK  [also labelled SPI1_SCK]
MCU30: U5001.30(PA6) ; port LCD_MISO  [also labelled SPI1_MISO]
MCU31: U5001.31(PA7) ; port LCD_MOSI  [also labelled SPI1_MOSI]
MCU32: CN5002.3 R5007.2 U5001.32(PC4)
MCU33: CN5002.4 R5006.2 U5001.33(PC5)
MCU34: CN5002.5 R5005.1 U5001.34(PB0)
MCU35: CN5002.6 U5001.35(PB1)
MCU36: CN5002.7 U5001.36(PB2)
MCU37: CN5002.8 U5001.37(PE7) ; port LCD_CS
MCU38: CN5002.9 U5001.38(PE8) ; port LCD_RST
MCU39: CN5002.10 U5001.39(PE9) ; port LCD_DC
MCU40: CN5002.11 U5001.40(PE10) ; port LCD_LED
MCU41: CN5002.12 U5001.41(PE11) ; port T_CS
MCU42: CN5002.13 U5001.42(PE12) ; port T_CLK
MCU43: CN5002.14 U5001.43(PE13) ; port T_DIN
MCU44: CN5002.15 U5001.44(PE14) ; port T_DO
MCU45: CN5002.16 U5001.45(PE15) ; port T_IRQ
MCU51: CN5001.2 U5001.51(PB12)
MCU52: CN5001.1 U5001.52(PB13)
MCU53: CN5001.4 S5001.2 U5001.53(PB14) ; port USART1_TX  [also labelled USART1_TX]
MCU54: CN5001.3 S5001.1 U5001.54(PB15) ; port USART1_RX  [also labelled USART1_RX]
MCU55: CN5001.6 SB5005.1 SB5006.1 U5001.55(PD8) ; port USART3_TX  [also labelled USART3_TX]
MCU56: CN5001.5 SB5004.1 SB5007.1 U5001.56(PD9) ; port USART3_RX  [also labelled USART3_RX]
MCU57: CN5001.8 U5001.57(PD10)
MCU58: CN5001.7 U5001.58(PD11)
MCU59: CN5001.10 U5001.59(PD12)
MCU60: CN5001.9 U5001.60(PD13)
MCU61: CN5001.12 U5001.61(PD14)
MCU62: CN5001.11 U5001.62(PD15)
MCU63: CN5001.14 SB5012.2 SB5014.2 U5001.63(PC6) ; port USART6_TX  [also labelled USART6_TX]
MCU64: CN5001.13 SB5013.2 SB5015.2 U5001.64(PC7) ; port USART6_RX  [also labelled USART6_RX]
MCU65: CN5001.16 U5001.65(PC8)
MCU66: CN5001.15 U5001.66(PC9)
MCU67: CN5001.18 U5001.67(PA8)
MCU68: R5027.1 U5001.68(PA9) ; port SPI2_SCK
MCU69: CN5001.20 U5001.69(PA10) ; port PA10
MCU78: CN5000.1 U5001.78(PC10)
MCU79: CN5000.2 U5001.79(PC11)
MCU80: CN5000.3 U5001.80(PC12)
MCU81: CN5000.4 U5001.81(PD0)
MCU82: CN5000.5 U5001.82(PD1)
MCU83: CN5000.6 U5001.83(PD2)
MCU84: CN5000.7 U5001.84(PD3)
MCU85: CN5000.8 U5001.85(PD4)
MCU86: CN5000.9 U5001.86(PD5)
MCU87: CN5000.10 U5001.87(PD6) ; port RESET_ESP
MCU88: CN5000.11 U5001.88(PD7) ; port RESET_LORA
MCU91: CN5000.12 R5014.1 U5001.91(PB5)
MCU92: CN5000.13 R5015.1 U5001.92(PB6)
MCU93: CN5000.14 R5017.1 U5001.93(PB7)
MCU94: CN5000.15 R5009.2 U5001.94(BOOT0)
MCU95: CN5000.16 U5001.95(PB8) ; port ADS1115A_ARLET/DRY
MCU96: CN5000.17 U5001.96(PB9) ; port ADS1115B_ARLET/DRY
MCU97: CN5000.18 R5032.1 U5001.97(PE0) U5004.7(WP) ; port WP
MCU98: CN5000.19 U5001.98(PE1)
OSC32_IN: C5011.1 U5001.8(PC14-OSC32_IN) X5001.1
OSC32_OUT: C5012.1 U5001.9(PC15-OSC32_OUT) X5001.4
OSC_IN: C5007.1 U5001.12(PH0-OSC_IN) X5000.1
OSC_OUT: C5008.1 U5001.13(PH1-OSC_OUT) X5000.2
USB1_N: CN5001.17 R5001.2 U5001.70(PA11)
USB1_P: CN5001.19 R5010.2 U5001.71(PA12)
NetB5000_2: B5000.2 R5000.1 U5001.21(VDDA)
NetB5001_1: B5001.1 C5013.1 R5016.1 ; port RESET#
NetB5002_1: B5002.1 C5014.1 R5008.2
NetC5009_1: C5009.1 U5001.73(VCAP)
NetC5010_1: C5010.1 U5001.48(VCAP)
NetD5001_1: D5001.1 R5011.2
NetD5001_2: D5001.2 U5005.3(OS)
NetJ2000_1: SB5004.2 SB5006.2 ; port RS485_RX
NetJ2000_3: SB5005.2 SB5007.2 ; port RS485_TX
NetJ5000_2: J5000.2 R5009.1
NetR5000_2: R5000.2 U5001.20(VREF+)
NetR5004_1: R5004.1 U5005.7(A0)
NetR5026_2: R5026.2 U5002.2(1A)
NetR5027_2: R5027.2 U5002.5(2A)
NetR5028_2: R5028.2 U5002.9(3A)
NetR5029_1: R5029.1 U5003.7 ; port DO_LLS
NetR5029_2: R5029.2 U5002.12(4A)
NetS5001_3: S5001.3 SB5009.2 SB5010.2
NetS5001_4: S5001.4 SB5008.2 SB5011.2
NetSB5000_1: SB5000.1 SB5003.1 ; port ESP_TXD
NetU5002_3: U5002.3(1Y) U5003.3 ; port SD_DI_LLS
NetU5002_6: U5002.6(2Y) U5003.5 ; port SD_SCK_LLS
NetU5002_8: U5002.8(3Y) U5003.2 ; port SD_CS_LLS

Not connected (* = marked no-connect by the designer): CN5000 20*; CN5002 2* 19* 20*; U5003 1* 8* CD*

### Layout directives
differential pair: USB1_N, USB1_P

### Notes on the sheet
- REVERT
- Labels drawn without touching a wire or pin: NetLabel48
- PROJECT:
- A2
- SIZE
- Author:
- Instructors:
- Project Document Name:
- Modified day:
- Approved by:
- (in symbol FF-3016) SD CARD SLOT
- (in symbol FF-3017) +; -

### Library data of the parts
B5000 = FF-4021: FERRITE BEAD 600 OHM 0603 1LN; TH/SMD: SMD; Value: 600 OHM; Design Item ID: FF-4021; Type: FERRITE BEAD; Tolerance: N/A; Voltage: N/A; Power Rate: N/A; Size: 0603; Supplier: THEGIOIIC; Supplier Part Number: FERRITE BEAD 600 OHM 0603 1LN; Supplier Link: https://www.thegioiic.com/ferrite-bead-600-ohm-0603-1ln
B5001 B5002 = FF-3007: Nút Nhấn 3x4mm Cao 2.5mm 2 Chân SMD; Design Item ID: FF-3007; Type: BUTTON; TH/SMD: SMD; Value: N/A; Tolerance: N/A; Voltage: N/A; Power Rate: N/A; Size: 3X4MM; Supplier: THEGIOIIC; Supplier Part Number: Nút Nhấn 3x4mm Cao 2.5mm 2 Chân SMD; Supplier Link: https://www.thegioiic.com/nut-nhan-3x4mm-cao-2-5mm-2-chan-smd
C5000-C5006 C5013-C5018 = FF-1008: CAP CER SMD 100nF 10% 50V 0603; Type: CAP CER; Design Item ID: FF-1008; TH/SMD: SMD; Value: 100nF; Tolerance: 10%; Power Rate: N/A; Supplier: THEGIOIIC; Supplier Part Number: 10%, 0603 (1608 Metric); Supplier Link: https://www.thegioiic.com/tu-gom-0603-100nf-0-1uf-50v
C5007 C5008 = FF-1013: CAP CER SMD 1.5pF 10% 50V 0603; Type: CAP CER; Design Item ID: FF-1013; TH/SMD: SMD; Value: 1.5pF; Tolerance: 10%; Power Rate: N/A; Supplier: THEGIOIIC; Supplier Part Number: 10%, 0603 (1608 Metric); Supplier Link: https://www.thegioiic.com/tu-gom-0603-1-5pf-50v
C5009 C5010 = FF-1004: CAP CER SMD 2.2uF 10% 50V 0603; Type: CAP CER; Design Item ID: FF-1004; TH/SMD: SMD; Value: 2.2uF; Tolerance: 10%; Power Rate: N/A; Supplier: THEGIOIIC; Supplier Part Number: 10%, 0603 (1608 Metric); Supplier Link: https://www.thegioiic.com/tu-gom-0603-2-2uf-50v
C5011 C5012 = FF-1014: CAP CER SMD 3.9pF 10% 50V 0603; Type: CAP CER; Design Item ID: FF-1014; TH/SMD: SMD; Value: 3.9pF; Tolerance: 10%; Power Rate: N/A; Supplier: N/A; Supplier Part Number: N/A; Supplier Link: N/A
CN5000-CN5002 = FF-3025: Design Item ID: FF-3025; Type: CONNECTOR; TH/SMD: SMD; Value: N/A; Tolerance: N/A; Voltage: N/A; Power Rate: N/A; Size: N/A; Supplier: N/A; Supplier Part Number: N/A; Supplier Link: N/A
CN5003 = FF-3021: Design Item ID: FF-3021; Type: CONNECTOR; TH/SMD: SMD; Value: N/A; Tolerance: N/A; Voltage: N/A; Power Rate: N/A; Size: 8X2X2.54MM; Supplier: THEGIOIIC; Supplier Part Number: Hàng Rào Đực Đôi 2.54mm 80 Chân 2 Hàng SMD; Supplier Link: https://www.thegioiic.com/hang-rao-duc-doi-2-54mm-80-chan-2-hang-smd
D5000 = FF-4018: LED RGB 5050 Dán SMD Trong Suốt; Value: 5 x 5 x 1.5mm; Design Item ID: FF-4018; Type: LED RGB; TH/SMD: SMD; Tolerance: N/A; Voltage: N/A; Power Rate: N/A; Size: 5050; Supplier: THEGIOIIC; Supplier Part Number: LED RGB 5050 Dán SMD Trong Suốt; Supplier Link: https://www.thegioiic.com/led-rgb-5050-dan-smd-trong-suot
D5001 = FF-4011: LED RED 0603; TH/SMD: SMD; Design Item ID: FF-4011; Type: LED; Value: N/A; Tolerance: N/A; Voltage: N/A; Power Rate: N/A; Size: 0603; Supplier: THEGIOIIC; Supplier Part Number: LED Đỏ 0603 Dán SMD Trong Suốt; Supplier Link: https://www.thegioiic.com/led-do-0603-dan-smd-trong-suot
H5000 = FF-3020: TH/SMD: TH; Design Item ID: FF-3020; Type: JUMPER; Value: N/A; Tolerance: N/A; Voltage: N/A; Power Rate: N/A; Size: 5X2 X 2.54mm; Supplier: N/A; Supplier Part Number: N/A; Supplier Link: N/A
J5000 = FF-3014: TH/SMD: TH; Design Item ID: FF-3014; Type: JUMPER; Value: N/A; Tolerance: N/A; Voltage: N/A; Power Rate: N/A; Size: 2 X 2.54mm; Supplier: N/A; Supplier Part Number: N/A; Supplier Link: N/A
R5000 = FF-0003: RESISTOR SMD 0R OHM 1% 100mW 0603; Power Rate: 100mW; Design Item ID: FF-0003; Type: RESISTOR; TH/SMD: SMD; Value: 0R; Tolerance: 1%; Voltage: N/A; Supplier: THEGIOIIC; Supplier Part Number: 0R0, 1/10W; Supplier Link: https://www.thegioiic.com/dien-tro-0-ohm-0603-1-
R5001 R5008 R5010 R5014 R5015 R5017 = FF-0022: RESISTOR SMD 20R OHM 1% 100mW 0603; Power Rate: 100mW; Design Item ID: FF-0022; Type: RESISTOR; TH/SMD: SMD; Value: 20R; Tolerance: 1%; Voltage: N/A; Supplier: THEGIOIIC; Supplier Part Number: 20R (Code 200), 1/10W; Supplier Link: https://www.thegioiic.com/dien-tro-20-ohm-0603-1-
R5002 R5003 = FF-0020: RESISTOR SMD 10KR OHM 1% 100mW 0603; Power Rate: 100mW; Design Item ID: FF-0020; Type: RESISTOR; TH/SMD: SMD; Value: 10KR; Tolerance: 1%; Voltage: N/A; Supplier: THEGIOIIC; Supplier Part Number: 103, 1/10W; Supplier Link: https://www.thegioiic.com/dien-tro-10-kohm-0603-1-
R5004 R5009 R5016 R5030-R5032 = FF-0016: RESISTOR SMD 4.7KR OHM 1% 100mW 0603; Power Rate: 100mW; Design Item ID: FF-0016; Type: RESISTOR; TH/SMD: SMD; Value: 4.7KR; Tolerance: 1%; Voltage: N/A; Supplier: THEGIOIIC; Supplier Part Number: 472, 1/10W; Supplier Link: https://www.thegioiic.com/dien-tro-4-7-kohm-0603-1-
R5005-R5007 R5011 = FF-0001: RESISTOR SMD 680R OHM 5% 100mW 0603; Power Rate: 100mW; Design Item ID: FF-0001; Type: RESISTOR; TH/SMD: SMD; Value: 680R; Tolerance: 5%; Voltage: N/A; Supplier: THEGIOIIC; Supplier Part Number: 681, 1/10W; Supplier Link: https://www.thegioiic.com/dien-tro-680-ohm-0603-5-
R5026-R5029 = FF-0051: RESISTOR SMD 3.3KR OHM 1% 100mW 0603; Power Rate: 100mW; Design Item ID: FF-0051; Type: RESISTOR; TH/SMD: SMD; Value: 3.3KR; Tolerance: 1%; Voltage: N/A; Supplier: THEGIOIIC; Supplier Part Number: Điện Trở 3.3 KOhm 0603 1%; Supplier Link: https://www.thegioiic.com/dien-tro-3-3-kohm-0603-1-
S5001 = FF-3009: DIP SWITCH 1.27mm 2 CONTACT; TH/SMD: SMD; Design Item ID: FF-3009; Type: SWITCH; Value: N/A; Tolerance: N/A; Voltage: N/A; Power Rate: N/A; Size: 2 X 1.27mm; Supplier: THEGIOIIC; Supplier Part Number: Công Tắc DIP Switch Dán SMD 2 Bit 1.27mm; Supplier Link: https://www.thegioiic.com/cong-tac-dip-switch-dan-smd-2-bit-1-27mm
SB5000-SB5015 = FF-0052: RESISTOR SMD 0R OHM 1% 100mW 0603; Design Item ID: FF-0052; Power Rate: 100mW; Size: 0603; Type: RESISTOR; TH/SMD: SMD; Value: 0R; Tolerance: 1%; Voltage: N/A; Supplier: THEGIOIIC; Supplier Part Number: N/A; Supplier Link: N/A
U5000 = FF-3017: BS-6 Đế Pin CR2032 CR2025 Dán SMD; TH/SMD: SMD/TH; Design Item ID: FF-3017; Type: CONNECTOR; Value: N/A; Tolerance: N/A; Voltage: N/A; Power Rate: N/A; Size: BS-6; Supplier: THEGIOIIC; Supplier Part Number: BS-6 Đế Pin CR2032 CR2025 Dán SMD; Supplier Link: https://www.thegioiic.com/bs-6-de-pin-cr2032-cr2025-dan-smd
U5001 = FF-2011: 32-bit Arm® Cortex®-M7 480MHz MCUs, up to 2MB flash, up to 1MB RAM, 46 com. and analog interfaces; TH/SMD: SMD; Design Item ID: FF-2011; Type: IC; Value: STM32H743VIT6; Tolerance: N/A; Voltage: N/A; Power Rate: N/A; Size: LQFP-100; Supplier: SELF
U5002 = FF-2023: Quad buffer/line driver with 5 V tolerant input/outputs; 3-state; TH/SMD: SMD; Design Item ID: FF-2023; Type: IC; Value: 74LVC125APW; Tolerance: N/A; Voltage: N/A; Power Rate: N/A; Size: TSSOP-14; Supplier: THEGIOIIC; Supplier Part Number: 74LVC125APW; Supplier Link: N/A
U5003 = FF-3016: SDCARD SLOT 9 PIN PUSH PULL; TH/SMD: SMD/TH; Design Item ID: FF-3016; Type: CONNECTOR; Value: N/A; Tolerance: N/A; Voltage: N/A; Power Rate: N/A; Size: MiSD-PP-9P-V2; Supplier: THEGIOIIC; Supplier Part Number: MiSD-PP-9P-V2 Khay Thẻ Nhớ MicroSD 9 Chân Push-Push; Supplier Link: https://www.thegioiic.com/misd-pp-9p-v2-khay-the-nho-microsd-9-chan-push-push
U5004 = FF-2022: 512K I2C Serial EEPROM; TH/SMD: SMD; Design Item ID: FF-2022; Type: IC; Value: 24LC512; Tolerance: N/A; Voltage: N/A; Power Rate: N/A; Size: SOIC-8; Supplier: THEGIOIIC; Supplier Part Number: 24LC512; Supplier Link: https://www.thegioiic.com/24lc512t-i-sn-ic-eeprom-512kbit-8-soic
U5005 = FF-2025: Digital temperature sensor and thermal watchdog; TH/SMD: SMD; Design Item ID: FF-2025; Type: IC; Value: LM75BD; Tolerance: N/A; Voltage: N/A; Power Rate: N/A; Size: SOP-8; Supplier: THEGIOIIC; Supplier Part Number: LM75BD; Supplier Link: N/A
X5000 = FF-4023: CRYSTAL 25MHz 2PIN SMD 5 x 3.2mm, ±20ppm 12pF; Design Item ID: FF-4023; Type: CRYSTAL; TH/SMD: SMD; Value: 25MHz; Tolerance: N/A; Voltage: N/A; Power Rate: N/A; Size: 5032; Supplier: THEGIOIIC; Supplier Part Number: Thạch Anh 25MHz 5032 2 Chân SMD; Supplier Link: https://www.thegioiic.com/thach-anh-25mhz-5032-2-chan-smd
X5001 = FF-4022: 32.768kHz ±20ppm, 9pF 65kOhm, 7x1.5x1.4 mm; TH/SMD: SMD; Design Item ID: FF-4022; Type: CRYSTAL; Value: N/A; Tolerance: N/A; Voltage: N/A; Power Rate: N/A; Size: 7015; Supplier: THEGIOIIC; Supplier Part Number: Thach Anh 32.768KHz MC-146 Crystal 7015 4 Chân; Supplier Link: https://www.thegioiic.com/thach-anh-32-768khz-mc-146-crystal-7015-4-chan